# EAGLE design LoRa-Messenger-v1.1 (EAGLE 8.6.0)
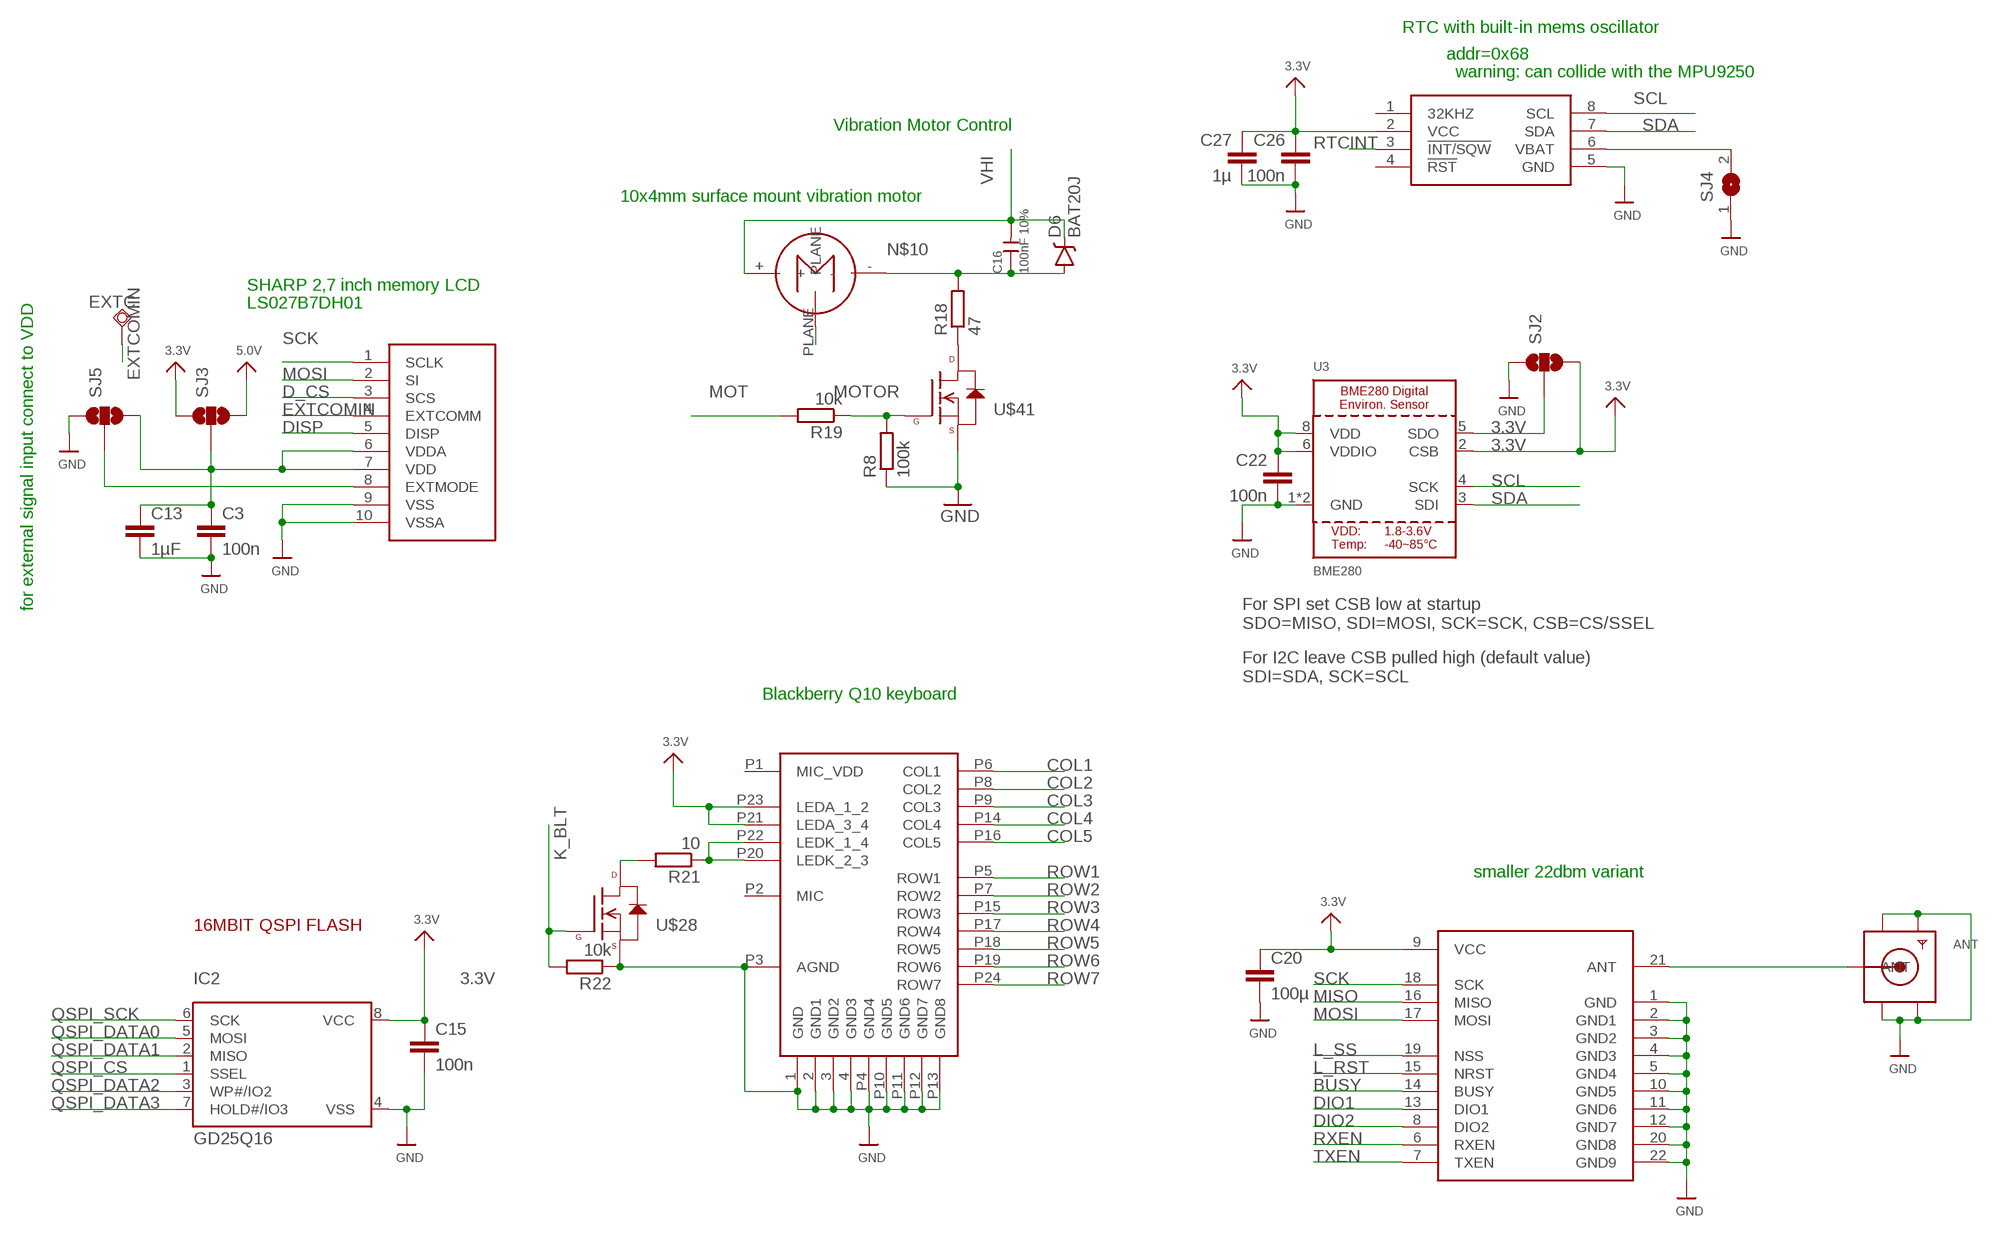
[diagram p0: schematic, sheet 1, part 1 of 3]
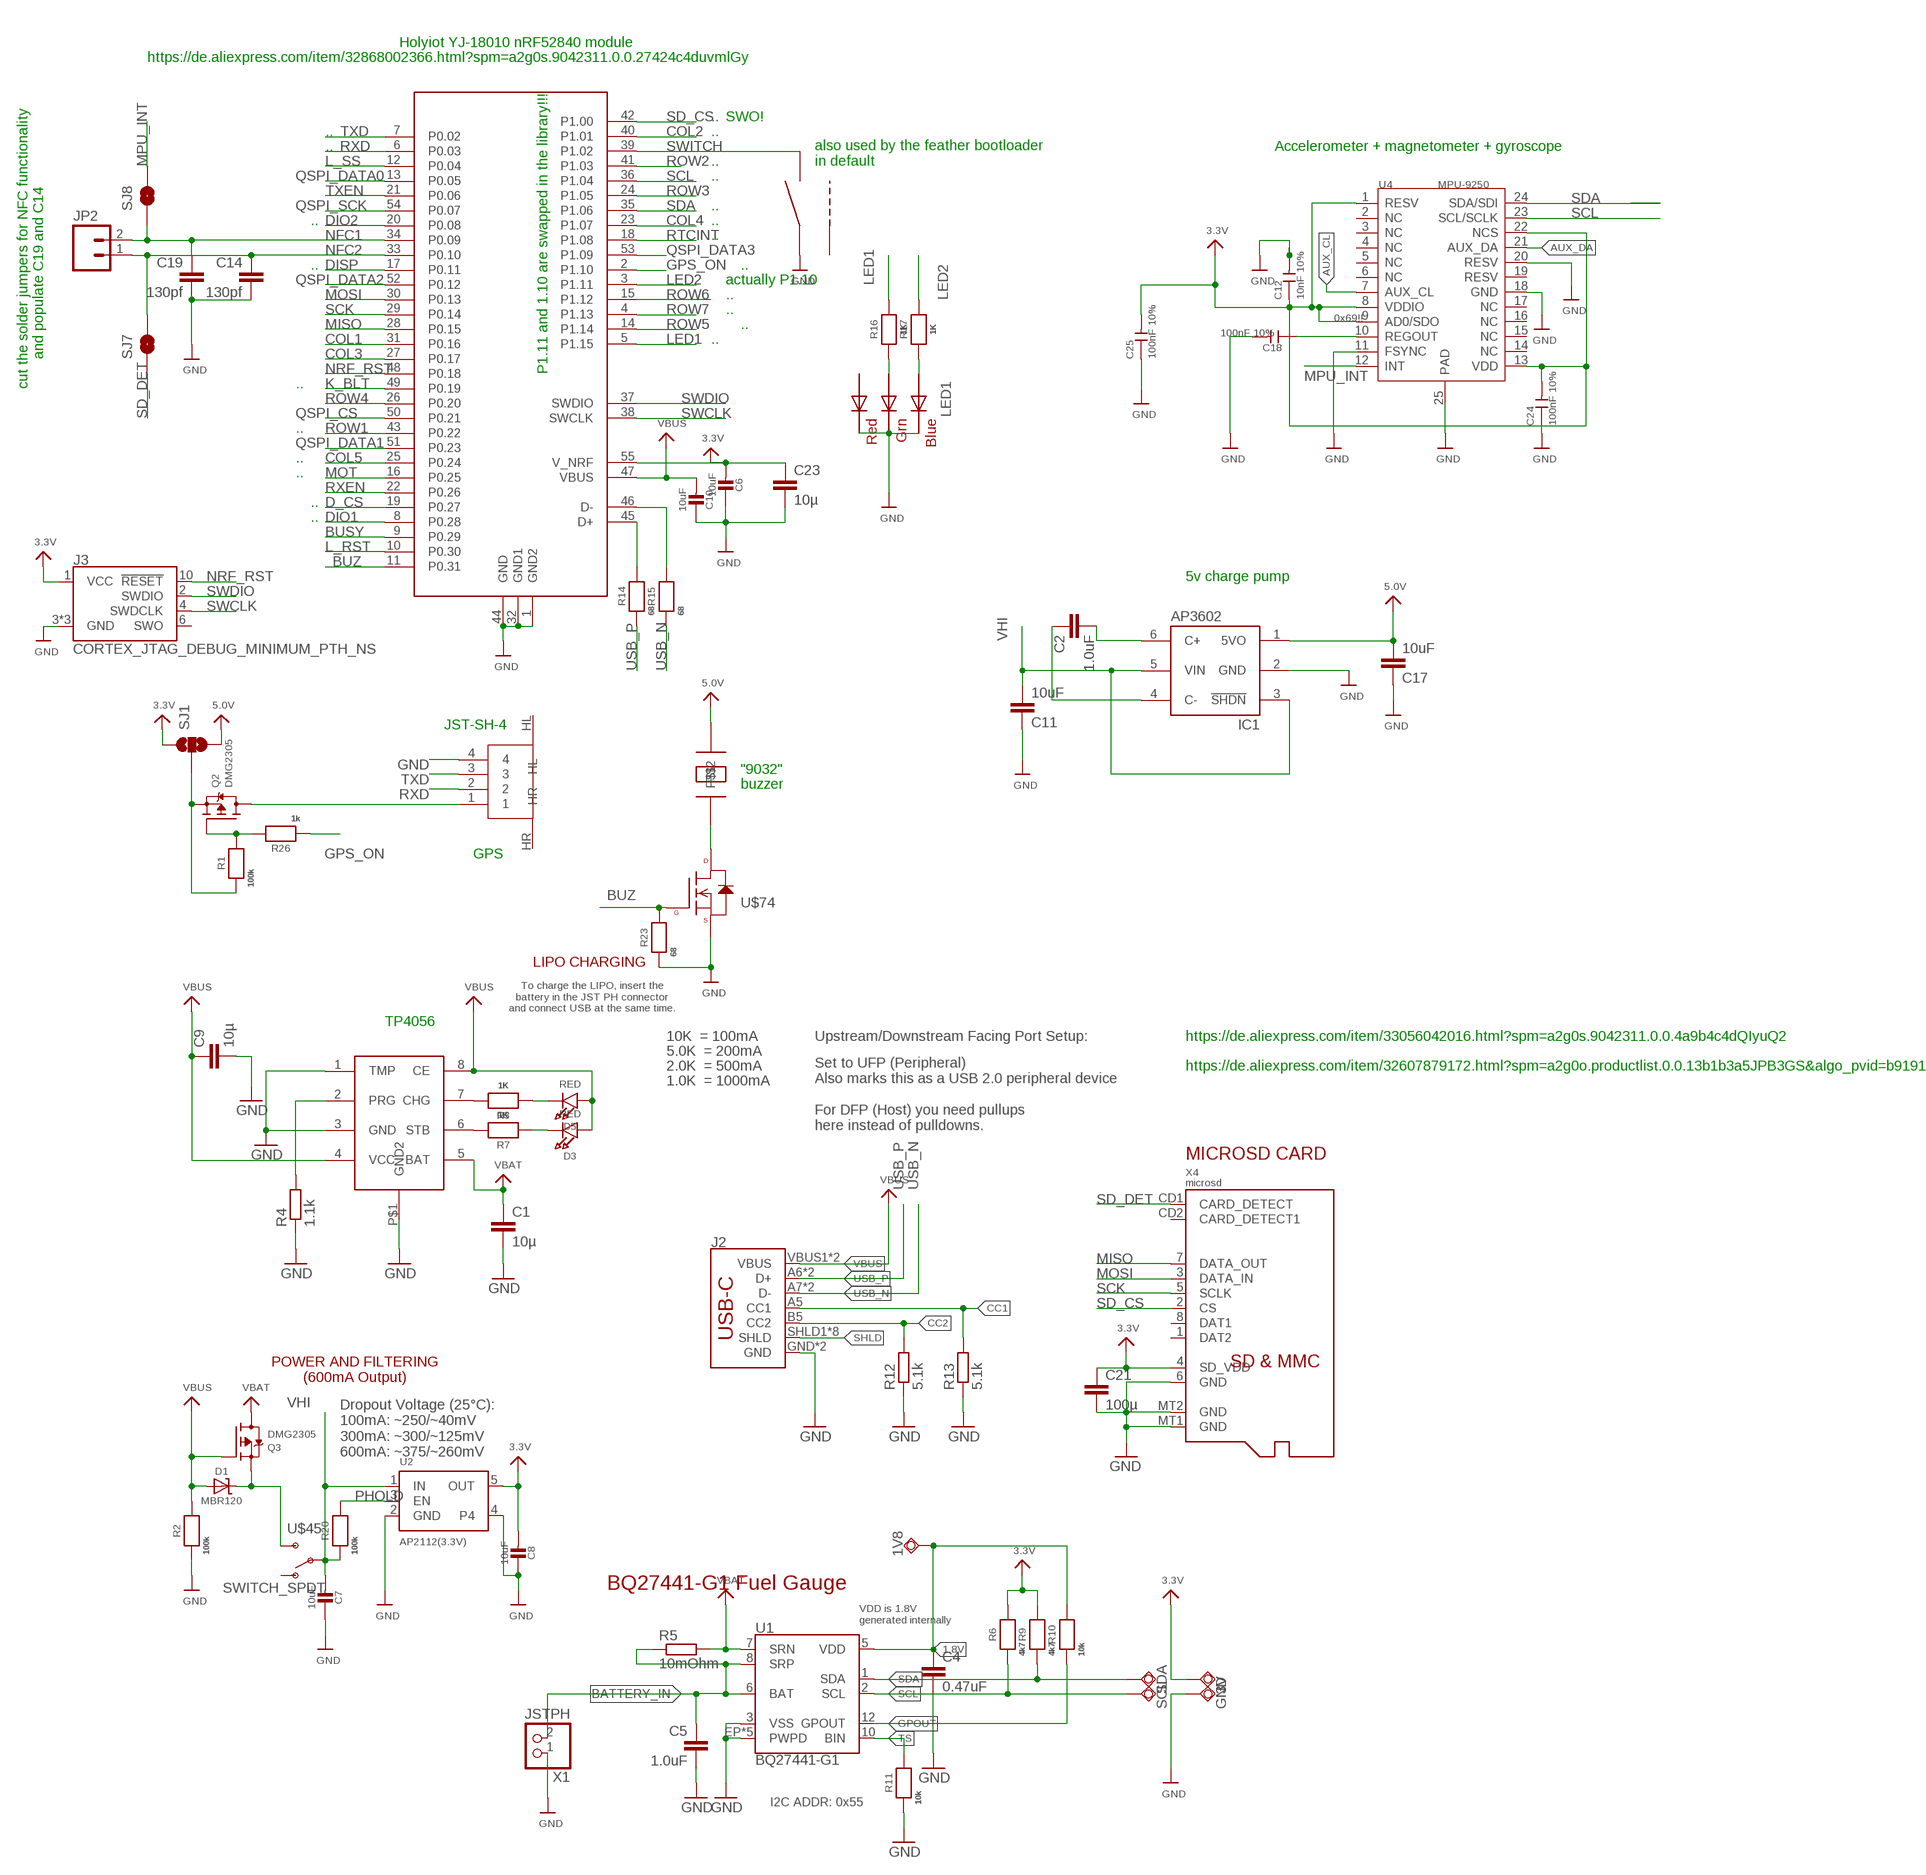
[diagram p1: schematic, sheet 1, part 2 of 3]
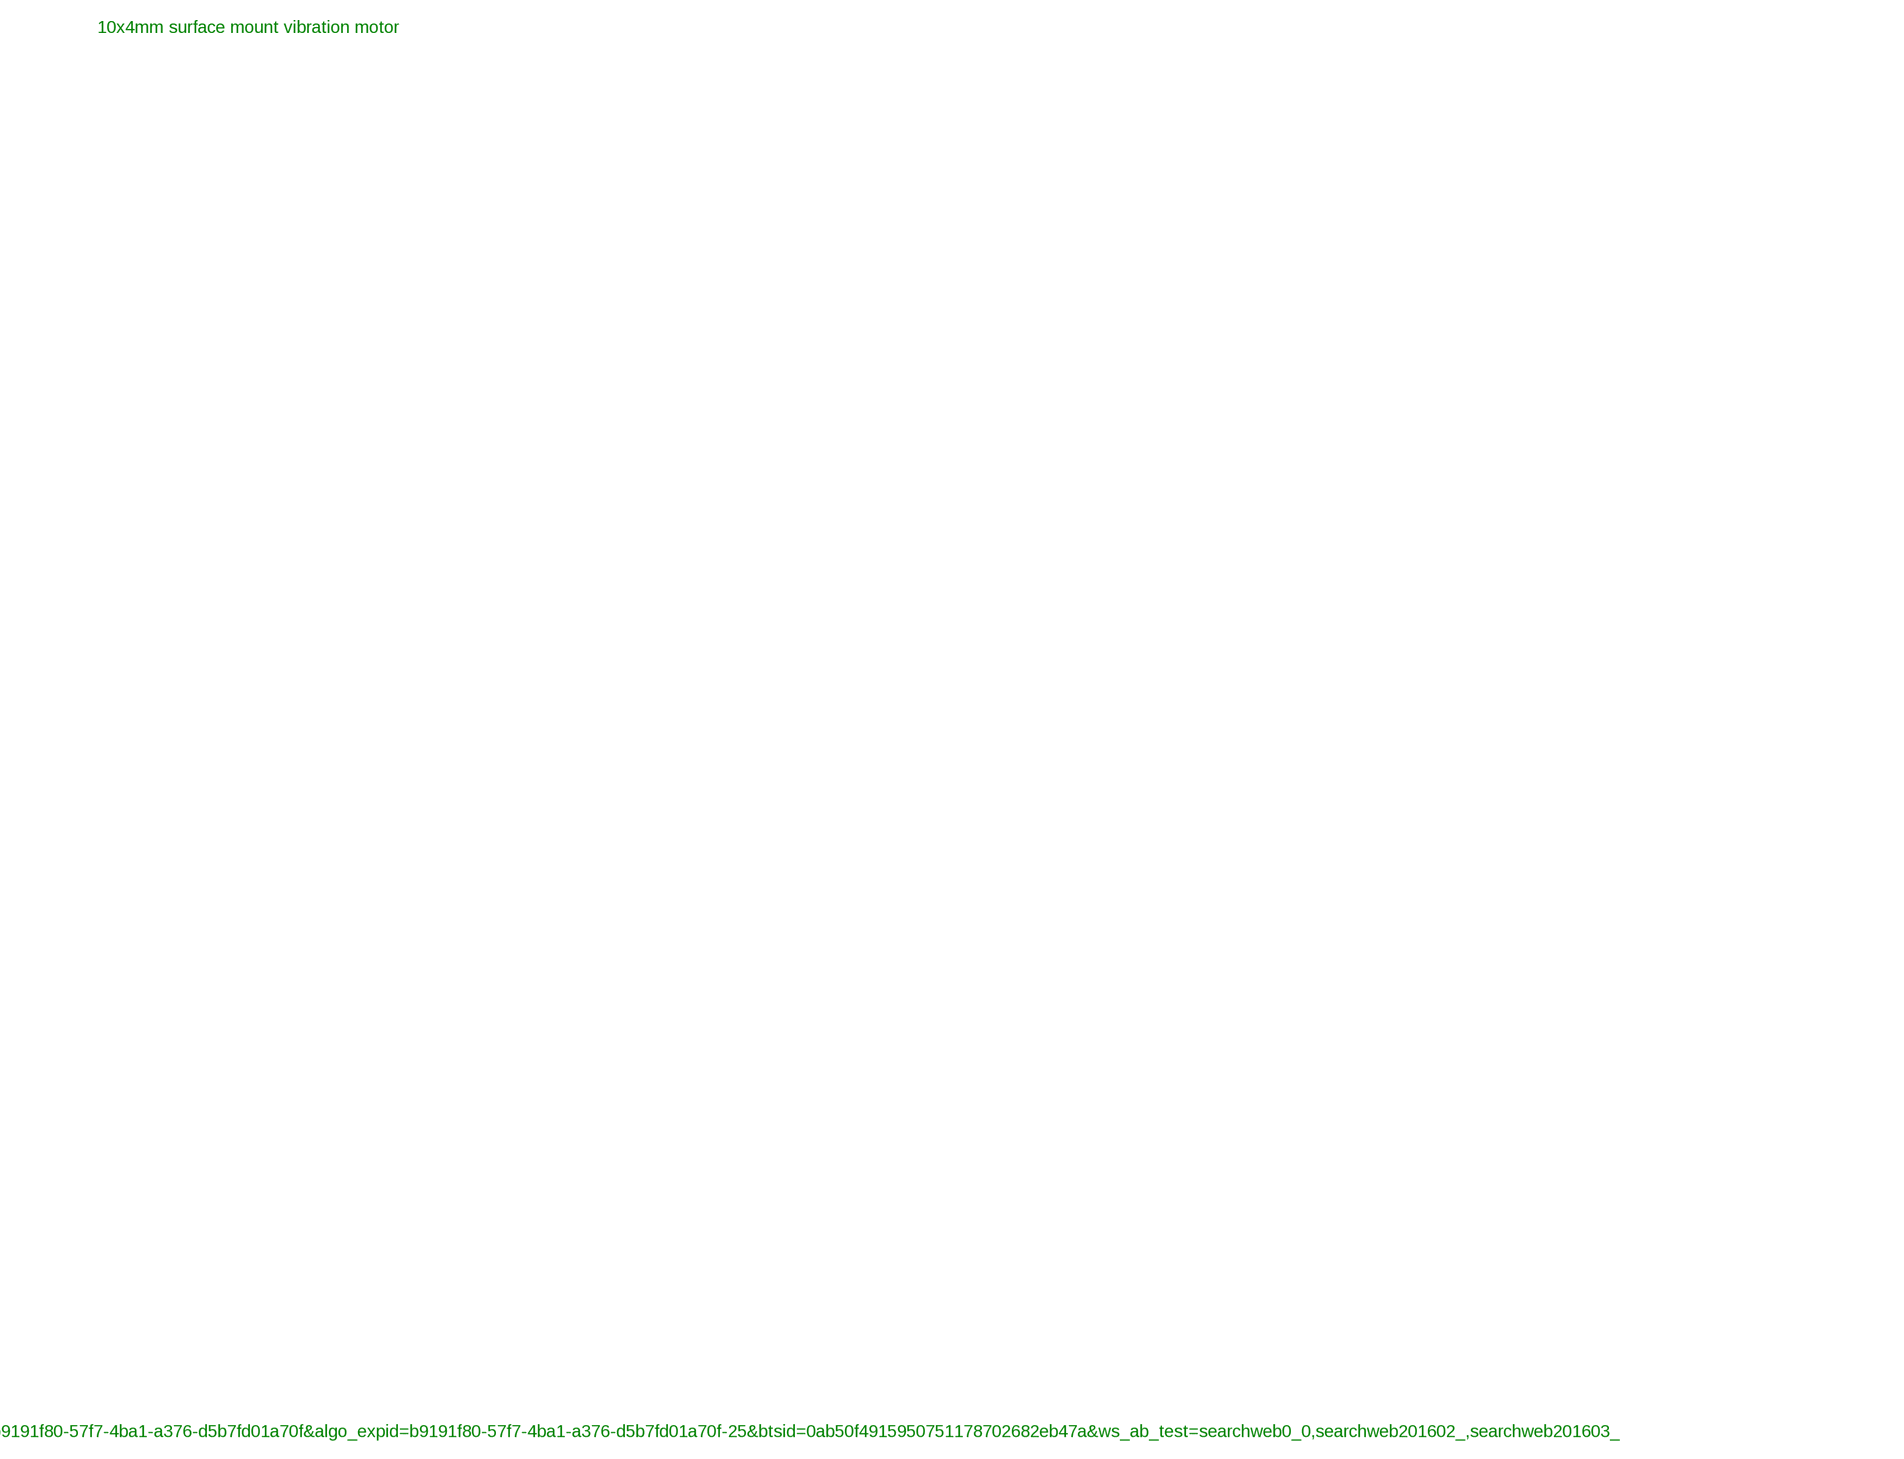
[diagram p2: schematic, sheet 1, part 3 of 3]

## Parts
1V8  TPSQTP13R  [TP13R]
3V  TPSQTP13R  [TP13R]
ANT  SMACONNECTOR_EDGE  [SMA_EDGELAUNCH]
C1  10µ  C-EUC0805  [C0805]
C2  1.0uF  1.0UF-16V-10%(0603)  [0603-CAP]
C3  100n  C-EUC0402  [C0402]
C4  0.47uF  CAP0603-CAP  [0603-CAP]
C5  1.0uF  1.0UF-16V-10%(0603)  [0603-CAP]
C6  10uF  CAP_CERAMIC0805-NOOUTLINE  [0805-NO]
C7  10uF  CAP_CERAMIC0805-NOOUTLINE  [0805-NO]
C8  10uF  CAP_CERAMIC0805-NOOUTLINE  [0805-NO]
C9  10µ  C-EUC0805  [C0805]
C10  10uF  CAP_CERAMIC0805-NOOUTLINE  [0805-NO]
C11  10uF  1.0UF-16V-10%(0603)  [0603-CAP]
C12  10nF 10%  CAP-0603  [C0603]
C13  1µF  C-EUC0402  [C0402]
C14  130pf  1.0UF-16V-10%(0603)  [0603-CAP]
C15  100n  C-EUC0402  [C0402]
C16  100nF 10%  CAP-0603  [C0603]
C17  10uF  1.0UF-16V-10%(0603)  [0603-CAP]
C18  100nF 10%  CAP-0603  [C0603]
C19  130pf  1.0UF-16V-10%(0603)  [0603-CAP]
C20  100µ  C-EUC1206  [C1206]
C21  100µ  C-EUC1206  [C1206]
C22  100n  1.0UF-16V-10%(0603)  [0603-CAP]
C23  10µ  C-EUC0805  [C0805]
C24  100nF 10%  CAP-0603  [C0603]
C25  100nF 10%  CAP-0603  [C0603]
C26  100n  1.0UF-16V-10%(0603)  [0603-CAP]
C27  1µ  1.0UF-16V-10%(0603)  [0603-CAP]
D1  MBR120  DIODE-SCHOTTKYSOD-123  [SOD-123]
D3  RED  LED0805_NOOUTLINE  [CHIPLED_0805_NOOUTLINE]
D5  RED  LED0805_NOOUTLINE  [CHIPLED_0805_NOOUTLINE]
D6  BAT20J  DIODE-SCHOTTKY-BAT20J  [SOD-323]
DWN2  LS12T2  [LS12T2]
EXTC.  TPSQTP13R  [TP13R]
GND  TPSQTP13R  [TP13R]
IC1  AP3602  [SOT23-6]
IC2  GD25Q16  SPIFLASH_8PINUX  [USON8]
J2  USB_C16PIN  [USB-C-16P]
J3  CORTEX_JTAG_DEBUG_MINIMUM_PTH_NS  [2X5-PTH-1.27MM-NO_SILK]
JP2  M02PTH  [1X02]
LED1  RGBLED5050  [RGBLED5050]
Q2  DMG2305  MOSFET-P  [SOT23-R]
Q3  DMG2305  MOSFET-P  [SOT23-R]
R1  100k  RESISTOR_0603_NOOUT  [0603-NO]
R2  100k  RESISTOR_0603_NOOUT  [0603-NO]
R3  1K  RESISTOR_0603_NOOUT  [0603-NO]
R4  1.1k  R-EU_R0603  [R0603]
R5  10mOhm  R-EU_R0805  [R0805]
R6  4k7  RESISTOR_0603_NOOUT  [0603-NO]
R7  1K  RESISTOR_0603_NOOUT  [0603-NO]
R8  100k  R-EU_R0603  [R0603]
R9  4k7  RESISTOR_0603_NOOUT  [0603-NO]
R10  10k  RESISTOR_0603_NOOUT  [0603-NO]
R11  10k  RESISTOR_0603_NOOUT  [0603-NO]
R12  5.1k  R-EU_R0603  [R0603]
R13  5.1k  R-EU_R0603  [R0603]
R14  68  RESISTOR_0603_NOOUT  [0603-NO]
R15  68  RESISTOR_0603_NOOUT  [0603-NO]
R16  1K  RESISTOR_0603_NOOUT  [0603-NO]
R17  1K  RESISTOR_0603_NOOUT  [0603-NO]
R18  47  R-EU_R0603  [R0603]
R19  10k  R-EU_R0603  [R0603]
R20  100k  RESISTOR_0603_NOOUT  [0603-NO]
R21  10  R-EU_R0603  [R0603]
R22  10k  R-EU_R0603  [R0603]
R23  68  RESISTOR_0603_NOOUT  [0603-NO]
R26  1k  RESISTOR_0603_NOOUT  [0603-NO]
SCL  TPSQTP13R  [TP13R]
SDA  TPSQTP13R  [TP13R]
SJ1  SOLDERJUMPER_2WAY-OLDS  [SJ_3]
SJ2  SOLDERJUMPER_2WAY-OLDS  [SJ_3]
SJ3  SOLDERJUMPER_2WAY-OLDS  [SJ_3]
SJ4  SJ  [SJ]
SJ5  SOLDERJUMPER_2WAY-OLDS  [SJ_3]
SJ7  SOLDERJUMPERTRACE  [SJ_2S-TRACE]
SJ8  SOLDERJUMPERTRACE  [SJ_2S-TRACE]
U1  BQ27441-G1  [PDSO-N12]
U2  AP2112(3.3V)  VREG_SOT23-5  [SOT23-5]
U3  BME280  [BME280]
U4  MPU-9250  [LEAD-QFN24]
U$2  BUZZER  [BUZZER]
U$7  Q10KEYBOARD  [Q10KEYBOARD]
U$10  AYF531035_SHARP_MEM_DISP  [AYF531035_Y5BW]
U$14  NRF52840  [NRF52840MOD]
U$17  JST-SH-3  [JST-SH-3]
U$28  N-CHANNEL-MOSFET-BSS138  [SOT23-3]
U$36  SX1292-EBYTE  [SX1262_EBYTE]
U$41  N-CHANNEL-MOSFET-BSS138  [SOT23-3]
U$45  SWITCH_SPDT  [KPS-1290]
U$46  VIBRO  [VIBRO]
U$47  TP4056BETTER_TP4056  [TP4056BETTER_SO-08]
U$69  DS3231M  [SO8]
U$74  N-CHANNEL-MOSFET-BSS138  [SOT23-3]
X1  JSTPH  CON_JST_PH_2PIN  [JSTPH2]
X4  microsd  MICROSD  [MICROSD]

## Nets
1.8V: 1V8.TP C4.1 R10.2 U1.5(VDD)
3.3V [power]: 3V.TP C6.2 C8.2 C12.1 C15.1 C20.1 C21.1 C22.1 C23.1 C24.2 C25.2 C26.1 C27.1 IC2.8(VCC) J3.1(VCC) R6.2 R9.2 SJ1.1 SJ2.3 SJ3.1 U2.5(OUT) U3.2(CSB) U3.6(VDDIO) U3.8(VDD) U4.1(RESV) U4.8(VDDIO) U4.9(AD0/SDO) U4.13(VDD) U4.22(NCS) U$7.P21(LEDA_3_4) U$7.P23(LEDA_1_2) U$14.55(V_NRF) U$36.9(VCC) U$69.2(VCC) X4.4(SD_VDD)
5.0V: C17.2 IC1.1(5VO) SJ1.3 SJ3.3 U$2.P$1
AUX_CL: U4.7(AUX_CL)
AUX_DA: U4.21(AUX_DA)
BATTERY_IN: C5.1 R5.1 U1.6(BAT) U1.8(SRP) X1.2
BUSY: U$14.9(P0.29) U$36.14(BUSY)
BUZ: R23.2 U$14.11(P0.31) U$74.1(G)
CC1: J2.A5(CC1) R13.2
CC2: J2.B5(CC2) R12.2
COL1: U$7.P6(COL1) U$14.31(P0.16)
COL2: U$7.P8(COL2) U$14.40(P1.01)
COL3: U$7.P9(COL3) U$14.27(P0.17)
COL4: U$7.P14(COL4) U$14.23(P1.07)
COL5: U$7.P16(COL5) U$14.25(P0.24)
D_CS: U$10.3(SCS) U$14.19(P0.27)
DIO1: U$14.8(P0.28) U$36.13(DIO1)
DIO2: U$14.20(P0.08) U$36.8(DIO2)
DISP [power]: U$10.5(DISP) U$14.17(P0.11)
EXTCOMIN: EXTC..TP U$10.4(EXTCOMM)
GND: ANT.GND@1(GND4) ANT.GND@2(GND3) ANT.GND@3(GND2) ANT.GND@4(GND1) C1.2 C3.2 C4.2 C5.2 C6.1 C7.1 C8.1 C9.2 C10.1 C11.1 C12.2 C13.2 C14.2 C15.2 C17.1 C18.2 C19.2 C20.2 C21.2 C22.2 C23.2 C24.1 C25.1 C26.2 C27.2 DWN2.2 GND.TP IC1.2(GND) IC2.4(VSS) J2.GND J2.GND2(GND) J3.3(GND) J3.5(GND) J3.9(GND) LED1.4(BLUE_C) LED1.5(RED_C) LED1.6(GREEN_C) R2.1 R4.1 R8.1 R11.1 R12.1 R13.1 R22.1 R23.1 SJ2.1 SJ4.1 SJ5.1 U1.3(VSS) U1.EP1(PWPD) U1.EP2(PWPD) U1.EP3(PWPD) U1.EP4(PWPD) U1.EP(PWPD) U2.2(GND) U2.4 U3.1(GND) U3.7(GND) U4.11(FSYNC) U4.18(GND) U4.20(RESV) U4.25(PAD) U$7.1(GND) U$7.2(GND1) U$7.3(GND2) U$7.4(GND3) U$7.P3(AGND) U$7.P4(GND4) U$7.P10(GND5) U$7.P11(GND6) U$7.P12(GND7) U$7.P13(GND8) U$10.9(VSS) U$10.10(VSSA) U$14.1(GND2) U$14.32(GND1) U$14.44(GND) U$17.4 U$28.2(S) U$36.1(GND) U$36.2(GND1) U$36.3(GND2) U$36.4(GND3) U$36.5(GND4) U$36.10(GND5) U$36.11(GND6) U$36.12(GND7) U$36.20(GND8) U$36.22(GND9) U$41.2(S) U$47.1(TMP) U$47.3(GND) U$47.P$1(GND2) U$69.5(GND) U$74.2(S) X1.1 X4.6(GND) X4.MT1(GND) X4.MT2(GND)
GPOUT: R10.1 U1.12(GPOUT)
GPS_ON: R26.1 U$14.2(P1.10)
K_BLT: R22.2 U$14.49(P0.19) U$28.1(G)
L_RST: U$14.10(P0.30) U$36.15(NRST)
L_SS: U$14.12(P0.04) U$36.19(NSS)
LED1: R16.2 U$14.5(P1.15)
LED2: R17.2 U$14.3(P1.11)
MISO: U$14.28(P0.15) U$36.16(MISO) X4.7(DATA_OUT)
MOSI: U$10.2(SI) U$14.30(P0.13) U$36.17(MOSI) X4.3(DATA_IN)
MOT: R19.2 U$14.16(P0.25)
MOTOR: R8.2 R19.1 U$41.1(G)
MPU_INT: SJ8.2 U4.12(INT)
N$1: R3.2 U$47.7(CHG)
N$2: C2.2 IC1.6(C+)
N$3: C2.1 IC1.4(C-)
N$4 [power]: D1.C Q3.2(S) U$45.S
N$5: Q2.1(G) R1.2 R26.2
N$6: R14.2 U$14.45(D+)
N$7: R15.2 U$14.46(D-)
N$8: R7.2 U$47.6(STB)
N$9: R18.1 U$41.3(D)
N$10: C16.1 D6.A R18.2 U$46.-
N$11: D5.C R3.1
N$12: D3.C R7.1
N$13: LED1.1(GREEN_A) R16.1
N$15: Q2.3(D) U$17.1
N$17: R21.1 U$7.P20(LEDK_2_3) U$7.P22(LEDK_1_4)
N$18: Q2.2(S) R1.1 SJ1.2
N$19: R21.2 U$28.3(D)
N$20: ANT.P(ANT) U$36.21(ANT)
N$21: LED1.3(BLUE_A) R17.1
N$25: SJ2.2 U3.5(SDO)
N$30: U$2.P$2 U$74.3(D)
N$41: C18.1 U4.10(REGOUT)
N$43: SJ4.2 U$69.6(VBAT)
N$44: C3.1 C13.1 SJ3.2 SJ5.3 U$10.6(VDDA) U$10.7(VDD)
N$45: SJ5.2 U$10.8(EXTMODE)
NFC1: C19.1 JP2.2 SJ8.1 U$14.34(P0.09)
NFC2: C14.1 JP2.1 SJ7.2 U$14.33(P0.10)
NRF_RST: J3.10(!RESET) U$14.48(P0.18)
PHOLD: R20.2 U2.3(EN)
PLANE: U$46.PLANE
PRG: R4.2 U$47.2(PRG)
QSPI_CS: IC2.1(SSEL) U$14.50(P0.21)
QSPI_DATA0: IC2.5(MOSI) U$14.13(P0.05)
QSPI_DATA1: IC2.2(MISO) U$14.51(P0.23)
QSPI_DATA2: IC2.3(WP#/IO2) U$14.52(P0.12)
QSPI_DATA3: IC2.7(HOLD#/IO3) U$14.53(P1.09)
QSPI_SCK: IC2.6(SCK) U$14.54(P0.07)
ROW1: U$7.P5(ROW1) U$14.43(P0.22)
ROW2: U$7.P7(ROW2) U$14.41(P1.03)
ROW3: U$7.P15(ROW3) U$14.24(P1.05)
ROW4: U$7.P17(ROW4) U$14.26(P0.20)
ROW5: U$7.P18(ROW5) U$14.14(P1.14)
ROW6: U$7.P19(ROW6) U$14.15(P1.12)
ROW7: U$7.P24(ROW7) U$14.4(P1.13)
RTCINT: U$14.18(P1.08) U$69.3(!INT/SQW)
RXD: U$14.6(P0.03) U$17.2
RXEN: U$14.22(P0.26) U$36.6(RXEN)
SCK: U$10.1(SCLK) U$14.29(P0.14) U$36.18(SCK) X4.5(SCLK)
SCL: R6.1 SCL.TP U1.2(SCL) U3.4(SCK) U4.23(SCL/SCLK) U$14.36(P1.04) U$69.8(SCL)
SD_CS: U$14.42(P1.00) X4.2(CS)
SD_DET: SJ7.1 X4.CD1(CARD_DETECT)
SDA: R9.1 SDA.TP U1.1(SDA) U3.3(SDI) U4.24(SDA/SDI) U$14.35(P1.06) U$69.7(SDA)
SHLD: J2.SHLD1(SHLD) J2.SHLD2(SHLD) J2.SHLD3(SHLD) J2.SHLD4(SHLD) J2.SHLD5(SHLD) J2.SHLD6(SHLD) J2.SHLD7(SHLD) J2.SHLD8(SHLD)
SWCLK: J3.4(SWDCLK) U$14.38(SWCLK)
SWDIO: J3.2(SWDIO) U$14.37(SWDIO)
SWITCH: DWN2.1 U$14.39(P1.02)
TS: R11.2 U1.10(BIN)
TXD: U$14.7(P0.02) U$17.3
TXEN: U$14.21(P0.06) U$36.7(TXEN)
USB_N: J2.A7(D-) J2.B7(D-) R15.1
USB_P: J2.A6(D+) J2.B6(D+) R14.1
VBAT [power]: C1.1 Q3.3(D) R5.2 U1.7(SRN) U$47.5(BAT)
VBUS [power]: C9.1 C10.2 D1.A D3.A D5.A J2.VBUS1(VBUS) J2.VBUS2(VBUS) Q3.1(G) R2.2 U$14.47(VBUS) U$47.4(VCC) U$47.8(CE)
VHI [power]: C7.2 C11.2 C16.2 D6.C IC1.3(!SHDN) IC1.5(VIN) R20.1 U2.1(IN) U$45.P U$46.+
Unconnected: DWN2.FRAME(FRM) J3.6(SWO) LED1.2(RED_A) U4.2(NC) U4.3(NC) U4.4(NC) U4.5(NC) U4.6(NC) U4.14(NC) U4.15(NC) U4.16(NC) U4.17(NC) U4.19(RESV) U$7.P1(MIC_VDD) U$7.P2(MIC) U$17.HL U$17.HR U$45.O U$69.1(32KHZ) U$69.4(!RST) X4.1(DAT2) X4.8(DAT1) X4.CD2(CARD_DETECT1)

## Notes on the sheet
- RTC with built-in mems oscillator
- addr=0x68
- warning: can collide with the MPU9250
- Vibration Motor Control
- 10x4mm surface mount vibration motor
- SHARP 2,7 inch memory LCD
- LS027B7DH01
- for external signal input connect to VDD
- For SPI set CSB low at startup
  SDO=MISO, SDI=MOSI, SCK=SCK, CSB=CS/SSEL
- For I2C leave CSB pulled high (default value)
  SDI=SDA, SCK=SCL
- Blackberry Q10 keyboard
- smaller 22dbm variant
- 16MBIT QSPI FLASH
- 10x4mm surface mount vibration motor
- Holyiot YJ-18010 nRF52840 module
- https://de.aliexpress.com/item/32868002366.html?spm=a2g0s.9042311.0.0.27424c4duvmlGy
- .. | SWO!
- .. | ..
- .. | Accelerometer + magnetometer + gyroscope
- ..
- also used by the feather bootloader 
  in default
- ..
- ..
- .. | ..
- ..
- .. | ..
- actually P1.10
- ..
- ..
- 0x69!!
- ..
- ..
- and populate C19 and C14
- P1.11 and 1.10 are swapped in the library!!!
- cut the solder jumpers for NFC functionality | ..
- ..
- ..
- ..
- ..
- ..
- 5v charge pump
- JST-SH-4
- "9032"
- buzzer
- GPS
- LIPO CHARGING
- To charge the LIPO, insert the
  battery in the JST PH connector
  and connect USB at the same time.
- TP4056
- 10K  = 100mA | Upstream/Downstream Facing Port Setup: | https://de.aliexpress.com/item/33056042016.html?spm=a2g0s.9042311.0.0.4a9b4c4dQIyuQ2
- 5.0K  = 200mA
- 2.0K  = 500mA | https://de.aliexpress.com/item/32607879172.html?spm=a2g0o.productlist.0.0.13b1b3a5JPB3GS&algo_pvid=b9191f80-57f7-4ba1-a376-d5b7fd01a70f&algo_expid=b9191f80-57f7-4ba1-a376-d5b7fd01a70f-25&btsid=0ab50f4915950751178702682eb47a&ws_ab_test=searchweb0_0,searchweb201602_,searchweb201603_
- 1.0K  = 1000mA
- Set to UFP (Peripheral)
  Also marks this as a USB 2.0 peripheral device
  
  For DFP (Host) you need pullups
  here instead of pulldowns.
- MICROSD CARD
- POWER AND FILTERING
  (600mA Output)
- Dropout Voltage (25°C):
  100mA: ~250/~40mV
  300mA: ~300/~125mV
  600mA: ~375/~260mV
- BQ27441-G1 Fuel Gauge
- VDD is 1.8V
  generated internally
- I2C ADDR: 0x55

## Library data of the parts
1V8 3V EXTC. GND SCL SDA = testpad:TPSQ: Test pad
ANT = adafruit:SMACONNECTOR: SMA Connector 90° DIP SMA Connector, 50 Ohm (4UConnector: 07259)
C1 C9 C20 C21 C23 = rcl:C-EU: CAPACITOR, European symbol; SPICEPREFIX: C
C2 C5 = SparkFun-Capacitors:1.0UF-16V-10%(0603): CAP-00868; PROD_ID: CAP-00868
C3 C13 C15 = rcl:C-EU: CAPACITOR, European symbol
C4 = SparkFun-Capacitors:CAP: Capacitor Standard 0603 ceramic capacitor, and 0.1" leaded capacitor.; PROD_ID: CAP-13216
C6-C8 C10 = microbuilder:CAP_CERAMIC: Ceramic Capacitors For new designs, use the packages preceded by an '_' character since they are more reliable: The following footprints should be used on most boards: _0402 - Standard footprint for regular board layouts _0603 - Standard footprint for regular board layouts _0805 - Standard footprint for regular board layouts _1206 - Standard footprint for regular board layouts For extremely tight-pitch boards where space is at a premium, the following 'micro-pitch' footprints can be used (smaller pads, no silkscreen outline, etc.): _0402MP - Micro-pitch footprint for very dense/compact boards _0603MP - Micro-pitch footprint for very dense/compact boards _0805MP - Micro-pitch footprint for very dense/compact boards _1206MP - Micro-pitch footprint for very dense/compact boards
C11 C14 C17 C19 C22 C26 C27 = SparkFun-Capacitors:1.0UF-16V-10%(0603): CAP-00868; PROD_ID: CAP-00868; VALUE: 1.0uF
C12 C16 C18 C24 C25 = Discrete-new:CAP: Ceramic Capacitors
D1 = microbuilder:DIODE-SCHOTTKY
D3 D5 = microbuilder:LED: LED 0603 - 0603 Surface Mount Package 2mA: Green LED - Low Power (3.9mcd, 2ma, 1.7Vf) - Digikey: 475-2709-2-ND Orange LED - Low Power (9.8mcd, 2ma, 1.8Vf) - Digikey: 475-1194-2-ND Red LED - Low Power (5mcd, 2ma, 1.8Vf) - Digikey: 475-1195-2-ND Yellow LED - Low Power (7mcd, 2ma, 1.8Vf) - Digikey: 475-1196-2-ND 5mA: Blue LED - Low Power (17mcd, 5ma, 2.9Vf) - Digikey: LNJ937W8CRACT-ND 0805 - 0805 Surface Mount Package 2mA: Red LED (8.8mcd, 2mA, 1.8Vf, Clear) - Low Power [Digikey: 475-2510-1-ND] Green LED (5mcd, 2mA, 1.8Vf, Clear) - Low Power [Digikey: 475-2730-1-ND] Yellow LED (11.3mcd, 2mA, 1.8Vf, Clear) - Low Power [Digikey: 475-2555-1-ND] 20mA: Red LED (104mcd, 20mA, Diffused) - LS R976 [Digikey: 475-1278-6-ND] Red LED (12mcd, 20mA, 2.0Vf, Clear) - APT2012EC [Digikey: 754-1128-1-ND] Green LED (15mcd, 20mA, 2.2Vf, Clear) - APT2012GC [Digikey: 754-1131-1-ND] Orange LED (160mcd, 20mA, 2.1Vf, Clear) - APT2012SECK [Digikey: 754-1130-1-ND] 1206 - 1206 Surface Mount Package Green LED (26mcd, 20mA, Diffused) - LG N971 [Digikey: 475-1407-6-ND] Red LED (15mcd, 20mA, Diffused) - LH N974 [Digikey: 475-1416-6-ND] Cree - Cree High-Power Surface Mount LEDs XPEBWT-L1-0000-00D50 - White 111lm 350mA 2.9Vf 6200K 110° XTEAWT-00-0000-00000LEE3 - White 114lm 350mA 2.85Vf 5000K 115° Everlight - Everlight 45-21 Series Surface Mount LEDs 45-21/QK2C-B2832AC2CB2/2T - Warm White 2000mcd 20mA 3.25Vf 3050K 120° 45-21/LK2C-B38452C4CB2/2T - Nuetral White 2000mcd 20mA 3.25Vf 4150K 120° 45-21/LK2C-B50634C6CB2/2T - Cold White 2200mcd 20mA 3.25Vf 5650K 120° PLCC2 Reverse Mount LS T77K-J1L2-1-0-2-R18-Z - Red 11.25mcd 2mA 1.8Vf 630nm 120° LO T77K-L1M2-24-Z - Orange 19.6mcd 2mA 1.8Vf 606nm 120° LY T77K-K2M1-26-Z - Yellow 15.7mcd 2mA 1.8Vf 587nm 120°
D6 = SparkFun-DiscreteSemi:DIODE-SCHOTTKY: Schottky diodes in SFE's production catalog BAT20J 1A 23V 0.62Vf RB751 120mA 40V 0.37Vf PMEG4005EJ 0.5A 40V 0.42Vf MBRA140 1A 40V 0.5Vf B340A 3A 40V SMA; PROD_ID: DIO-11623
DWN2 = LS12T2:LS12T2
IC1 = microbuilder:AP3602
IC2 = microbuilder:SPIFLASH_8PIN: SOIC8 SPI Flash Be careful with the size since SOIC8 flash comes in several 'widths' SOIC8 150 mil M25P16 - 16Mbit (2Mbit x 8) Serial Flash (75MHz SPI Bus), Supply: 2.7-3.6V Digikey: SOIC8 - M25P16-VMN6P-ND SOIC8 208 mil W25Q16BVSSIG - 16Mbit (2Mbit x 8) Serial Flash (104MHz SPI Bus), Supply: 2.7-3.6V Digikey: SOIC8 - W25Q16BVSSIG-ND
J2 = SparkFun-Connectors:USB_C: USB Type C 16Pin Connector Super Speed pins not available on the 16-pin purely SMD connector so this part is best for USB 2.0 implementations. D1 and D2 are tied together enabling D+/- no matter which way the cable is plugged into the connector. The two channel configuration pins (CC1/2) are exposed. These are normally connected to ground via 5.1k resistors but can be reconfigured for high current/high power applications.; PROD_ID: CONN-14122
J3 = SparkFun-Connectors:CORTEX_JTAG_DEBUG_MINIMUM: Cortex Debug Connector - 10 pin Supports JTAG debug, Serial Wire debug, and Serial Wire Viewer. PTH and SMD connector options available. General Connector Information <http://infocenter.arm.com/help/topic/com.arm.doc.faqs/attached/13634/cortex_debug_connectors.pdf> Products: PTH Connector <http://www.digikey.com/product-detail/en/cnc-tech/3220-10-0100-00/1175-1627-ND/3883661> -via Digi-Key SparkFun PSoc <https://www.sparkfun.com/products/13229> SparkFun T <https://www.sparkfun.com/products/13810>
JP2 = SparkFun-Connectors:M02: Standard 2-pin 0.1" header. Use with - straight break away headers ( PRT-00116) - right angle break away headers (PRT-00553) - swiss pins (PRT-00743) - machine pins (PRT-00117) - female headers (PRT-00115) Molex polarized connector foot print use with: PRT-08233 with associated crimp pins and housings. 2.54_SCREWTERM for use with PRT-10571. 3.5mm Screw Terminal footprints for PRT-08084 5mm Screw Terminal footprints for use with PRT-08432
LED1 = adafruit:RGBLED: For 5050 RGB LEDs, the order of the LEDs may vary from one manufacturer to another!
Q2 Q3 = microbuilder:MOSFET-P: P-Channel Mosfet LEGEND VDS: Voltage Drain-Source ID: Drain Current RDS(ON): Drain-Source On-State Resistance VGS(TH): Gate-Source Threshold Voltage CISS: Drain-Source Input Capacitance SOT-23 Name VDS ID RDS(ON) VGS(TH) CISS Order Number IRLML5103 30V 760mA 600 mOhm -- 75pF @ 25V Digikey: IRLML5103PBFCT-ND IRLML6401 12V 4.3A 50 mOhm 950mV @ 250µA 830pF @ 10V Digikey: IRLML6401PBFTR-ND NTR0202PL 20V 400mA 800 mOhm 2.3V @ 250uA 70pF @ 5V Digikey: NTR0202PLT1GOSTR-ND NTR4101PT1G 20V 1.8A 85 mOhm 1.2V @ 250uA 675pF @ 10V Digikey: NTR4101PT1GOSCT-ND DMP2004K 20V 600mA 900 mOhm 1V @ 250uA 175pF @ 16V Digikey: DMP2004KDICT-ND PMV65XP 20V 3.9A 76 mOhm 950mV @ 1mA 725pF @ 20V Digikey: 568-2358-2-ND TO-252 Name VDS ID RDS(ON) VGS(TH) CISS Order Number AOD417 30V 25A 34 mOhm 3V @ 250µA 920pF @ 15V Digikey: 785-1106-2-ND PowerPak Name VDS ID RDS(ON) VGS(TH) CISS Order Number AON7401 30V 12A 14 mOhm 3V @ 250µA 2600pF @ 15V Digikey: 785-1302-1-ND
R1-R3 R6 R7 R9-R11 R14-R17 R20 R23 R26 = microbuilder:RESISTOR: Resistors For new designs, use the packages preceded by an '_' character since they are more reliable: The following footprints should be used on most boards: _0402 - Standard footprint for regular board layouts _0603 - Standard footprint for regular board layouts _0805 - Standard footprint for regular board layouts _1206 - Standard footprint for regular board layouts For extremely tight-pitch boards where space is at a premium, the following 'micro-pitch' footprints can be used (smaller pads, no silkscreen outline, etc.): _0402MP - Micro-pitch footprint for very dense/compact boards _0603MP - Micro-pitch footprint for very dense/compact boards _0805MP - Micro-pitch footprint for very dense/compact boards _1206MP - Micro-pitch footprint for very dense/compact boards
R4 R5 R12 R13 = rcl:R-EU_: RESISTOR, European symbol; SPICEPREFIX: R
R8 R18 R19 R21 R22 = rcl:R-EU_: RESISTOR, European symbol
SJ1-SJ3 SJ5 = SparkFun-Retired:SOLDERJUMPER_2WAY-OLD: Solder Jumper 2 way solder jumper
SJ4 = jumper:SJ: SMD solder JUMPER
SJ7 SJ8 = SparkFun-Retired:SOLDERJUMPER: Solder Jumper Standard SMD solder jumper. Used to automate production. Two varients : Normally Open and Normally Closed are the same, but have different paste layers. NC will have a large amount of paste and should jumper during reflow.
U1 = battery-management-temp:BQ27441-G1; PROD_ID: IC-13220
U2 = microbuilder:VREG_SOT23-5: SOT23-5 Fixed Voltage Regulators Part Current Out V Out V In V Dropout θJA (°C/W) TJ (°C) Digikey Part No. ADP121 150mA 3.3V 3.4-5.5V 0.09V @ 150mA -- -- ADP121-AUJZ33R7CT-ND ADP121 150mA 3.0V 3.1-5.5V 0.09V @ 150mA -- -- ADP121-AUJZ30R7CT-ND ADP122 300mA 3.3V 3.4-5.5V 0.085V @ 300mA -- -- ADP122AUJZ-3.3-R7CT-ND ADP1712 300mA 3.3V 3.5-5.5V 0.17V @ 300mA -- -- ADP1712AUJZ-3.3-R7TR-ND AP7311 (Low Cost) 150mA 3.3V 3.5-6V 0.15V @ 150mA -- -- AP7311-33WG-7DICT-ND LD39015M18R 150mA 1.8V 1.9V-5.5V 0.08V @ 100mA -- -- 497-6977-1-ND LP2985A-33DBVR 150mA 3.3V 3.3-16V 0.28V @ 150mA 206 150 296-18479-1-ND MCP1824T-3302E/OT 300mA 3.3V 3.5V-6V 0.2V @ 300mA -- -- MCP1824T-3302E/OTCT-ND MIC5205-2.5YM5 TR 150mA 2.5V 2.7-16V 0.165V @ 150mA -- -- 576-1257-2-ND MIC5205-3.0YM5 TR 150mA 3.0V 3.2V-16V 0.165V @ 150mA -- -- 576-1258-2-ND MIC5205-3.3YM5 TR 150mA 3.3V 3.5V-16V 0.165V @ 150mA -- -- 576-1259-2-ND TPS780330220 150mA 3.3V+2.2V 3.6-5.5V 250mV Max -- -- 296-23332-1-ND TDA3663/N1,135 100mA 3.3V 3.5-45V 0.18V @ 50mA -- -- 568-5343-1-ND Max operating temp can be calculated using θJA, TJ (max junction temperature), and power in watts. Set the "Maximum Ambient Temperature" until it reaches TJ ("Max Junction Temperature"), which is the absolute limit for safe use of the regulator: Heat Sink Temperature Calculator <http://www.daycounter.com/Calculators/Heat-Sink-Temperature-Calculator.phtml> For example, With 12V source into a 3.3V LP2985 and a 30mA load, we are dissipating (12V-3.3V) * 0.03A = 0.261W. With a θJA of 206 °C/W, a TJ of 150°C, and 261mW we can safely use the chip without a heat sink up to 75°C (=147.1°C Junction Temperature).
U3 = microbuilder:BME280: BME280 - Environmental Sensor (I2C + SPI)
U4 = template:MPU-9250
U$2 = buzzer:BUZZER
U$7 = q10keyboard:Q10KEYBOARD
U$10 = LS027B7DH01A:AYF531035_SHARP_MEM_DISP
U$14 = nrf52840mod:NRF52840
U$17 = JST-SH-4:JST-SH-3
U$28 U$41 U$74 = GeekAmmo:N-CHANNEL-MOSFET: N-Channel MOSFET Mode Field Effect Transistor; DATASHEET: http://www.fairchildsemi.com/ds/BS/BSS138.pdf; DIGIKEY: BSS138TR-ND; ELEMENT14: 2323154; URL: http://au.element14.com/fairchild-semiconductor/bss138/mosfet-n-ch-50v-220ma-sot-23/dp/2323154
U$36 = sx1262-EBYTE:SX1292-EBYTE
U$45 = SparkFun-Retired:SWITCH_SPDT: SWCH-10651 Side-actuated SPDT slide switch, as used on the Arduino Pro; PROD_ID: SWCH-10651
U$46 = vibro:VIBRO
U$47 = TP4056andGC5177:TP4056BETTER_TP4056
U$69 = ds3231M:DS3231M
X1 = microbuilder:CON_JST_PH_2PIN: JST 2-Pin Right-Angle Connector PH-Series - 4UConnector: 17311 SH-Series - 4UConnector: 07278
X4 = microbuilder:MICROSD: MicroSD/Transflash Card Holder with SPI pinout 3M: 2908-05WB-MG 4UConnector: 19656 Footprint courtesy: Adafruit Industries

## Net classes
1 power: width 0.254 mm

## Board
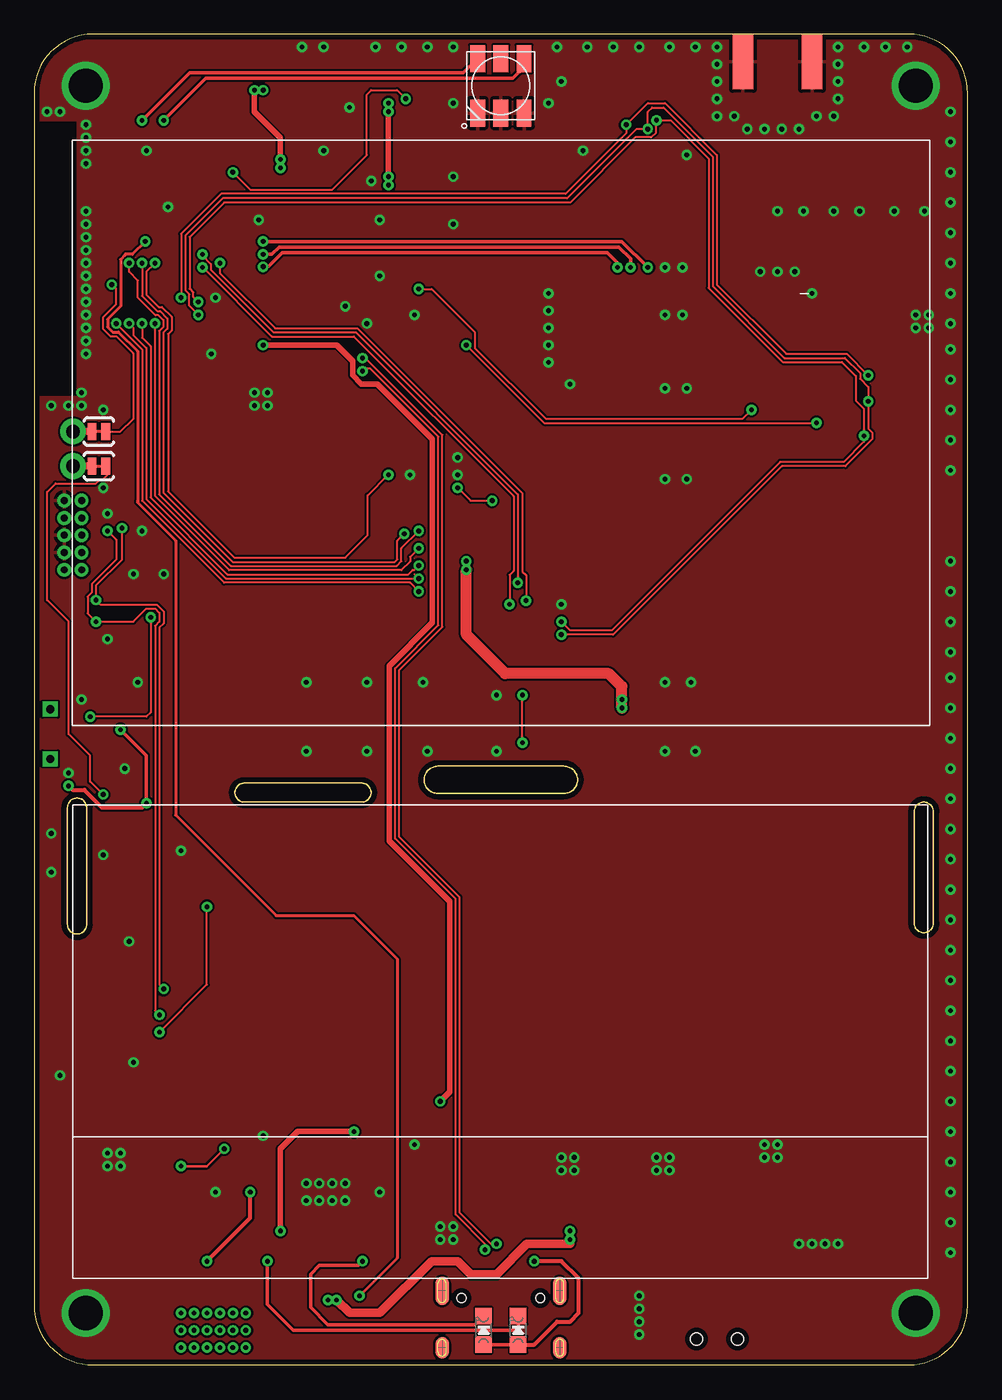
[diagram p3: board, top side]
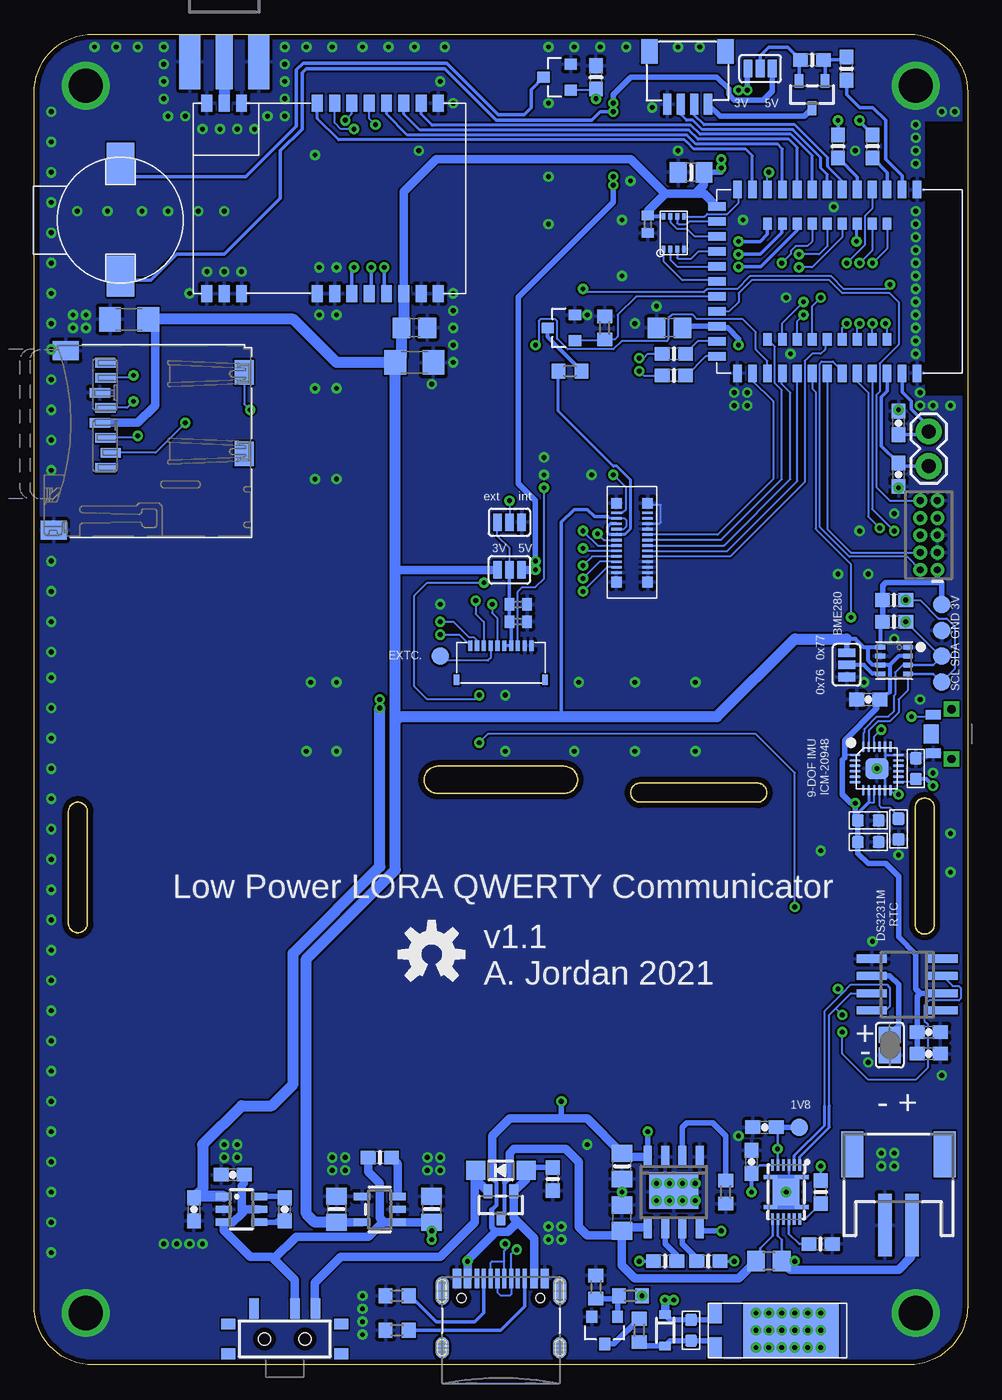
[diagram p4: board, bottom side, seen from below]

Size 68.58 x 97.79 mm. Coordinates in mm from the lower left corner, seen from the top.
Outline: 64.25,97.79 4.32,97.78 arc90 0,93.46 0,4.34 arc90 4.34,0 64.24,0 arc90 68.58,4.34 68.58,93.45 arc90 64.25,97.79
Copper layers (1*16): Top 0.035mm / dielectric 1.5mm / Bottom 0.035mm
Design rules "default *": minimum track width 6mil, minimum drill 0.35mm, track to track 6mil, track to pad 6mil, pad to pad 6mil, via to via 6mil, smd to smd 6mil, copper to edge 15mil, drill to drill 6mil, minimum pad ring 10mil, minimum via ring 8mil, stop-mask expansion 4mil, vias tented up to drill 20mil, thermal gap 10mil

### Footprints (pad centres in the part's own frame; a part is rotated, then mirrored left to right if it is on the bottom)
TP13R = smd 1.3 x 1.3: TP 0,0
SMA_EDGELAUNCH = smd 4.064 x 1.524: GND@1 2.032,-2.54; GND@2 2.032,2.54 | smd 4.064 x 1.524 bottom: GND@3 2.032,2.54; GND@4 2.032,-2.54 | smd 4.064 x 1.27: P 2.032,0
C0805 = smd 1.3 x 1.5: 1 -0.95,0; 2 0.95,0
0603-CAP = smd 1.1 x 1: 1 -0.85,0; 2 0.85,0
C0402 = smd 0.7 x 0.9: 1 -0.65,0; 2 0.65,0
0805-NO = smd 1.24 x 1.5: 1 -0.95,0; 2 0.95,0
C0603 = smd 0.889 x 0.889: 1 0,0.762; 2 0,-0.762
C1206 = smd 1.6 x 1.8: 1 -1.4,0; 2 1.4,0
SOD-123 = smd 1.4 x 1.4: A 1.85,0; C -1.85,0
CHIPLED_0805_NOOUTLINE = smd 1.2 x 1.2: A 0,-1.05; C 0,1.05
SOD-323 = smd 0.63 x 0.83: A 1.15,0; C -1.15,0
LS12T2 = smd 1.1 x 0.7: 1 0,1.4; 2 0,-1.4 | smd 1.1 x 1.4: FRAME -0.15,0 | drill 0.6 pad 1.016 square: P$4 1.35,-1.825; P$5 1.35,1.825
SOT23-6 = smd 0.55 x 1.2: 1 -0.95,-1.3; 2 0,-1.3; 3 0.95,-1.3; 4 0.95,1.3; 5 0,1.3; 6 -0.95,1.3
USON8 = smd 0.5 x 0.275: 1 -1.2,0.75; 2 -1.2,0.25; 3 -1.2,-0.25; 4 -1.2,-0.75; 5 1.2,-0.75; 6 1.2,-0.25; 7 1.2,0.25; 8 1.2,0.75
USB-C-16P = smd 0.3 x 1.45: A5 -1.25,0; A6 -0.25,0; A7 0.25,0; A8 1.25,0; B5 1.75,0; B6 0.75,0; B7 -0.75,0; B8 -1.75,0 | smd 0.6 x 1.45: GND -3.225,0; GND2 3.225,0 | smd 1 x 2.1: SHLD1 -4.32,-0.915; SHLD2 4.32,-0.915 | smd 1 x 2.1 bottom: SHLD3 -4.32,-0.915; SHLD4 4.32,-0.915 | smd 1 x 1.6: SHLD5 -4.32,-5.095; SHLD8 4.32,-5.095 | smd 1 x 1.6 bottom: SHLD6 -4.32,-5.095; SHLD7 4.32,-5.095 | smd 0.55 x 1.45: VBUS1 -2.45,0; VBUS2 2.45,0 | hole 0.65: -2.89,-1.445; 2.89,-1.445
2X5-PTH-1.27MM-NO_SILK = drill 0.508 pad 1: 1 -2.54,-0.635; 2 -2.54,0.635; 3 -1.27,-0.635; 4 -1.27,0.635; 5 0,-0.635; 6 0,0.635; 7 1.27,-0.635; 8 1.27,0.635; 9 2.54,-0.635; 10 2.54,0.635
1X02 = drill 1.016 pad 1.88: 1 0,0; 2 2.54,0
RGBLED5050 = smd 2 x 1.1: 1 -2,1.7; 2 -2,0; 3 -2,-1.7; 4 2,-1.7; 5 2,0; 6 2,1.7
SOT23-R = smd 0.635 x 1.016: 1 -0.95,-1; 2 0.95,-1; 3 0,1
0603-NO = smd 1.075 x 1: 1 -0.85,0; 2 0.85,0
R0603 = smd 1 x 1.1: 1 -0.85,0; 2 0.85,0
R0805 = smd 1.3 x 1.5: 1 -0.95,0; 2 0.95,0
SJ_3 = smd 0.635 x 1.27: 1 -0.889,0; 2 0,0; 3 0.889,0
SJ = smd 1.168 x 1.6: 1 -0.762,0; 2 0.762,0
SJ_2S-TRACE = smd 0.635 x 1.27: 1 -0.508,0; 2 0.508,0
PDSO-N12 = smd 0.2 x 0.85: 1 -1,-1.975; 2 -0.6,-1.975; 3 -0.2,-1.975; 4 0.2,-1.975; 5 0.6,-1.975; 6 1,-1.975; 7 1,1.975; 8 0.6,1.975; 9 0.2,1.975; 10 -0.2,1.975; 11 -0.6,1.975; 12 -1,1.975 | smd 1.95 x 1.95: EP 0,0 | smd 1 x 0.25: EP1 -1.15,1.1; EP2 -1.15,-1.1; EP3 1.15,-1.1; EP4 1.15,1.1
SOT23-5 = smd 0.55 x 1.2: 1 -0.95,-1.3; 2 0,-1.3; 3 0.95,-1.3; 4 0.95,1.3; 5 -0.95,1.3
BME280 = smd 0.7 x 0.35: 1 1.025,0.975; 2 1.025,0.325; 3 1.025,-0.325; 4 1.025,-0.975; 5 -1.025,-0.975; 6 -1.025,-0.325; 7 -1.025,0.325; 8 -1.025,0.975
LEAD-QFN24 = smd 0.8 x 0.2: 1 -1.6,1; 2 -1.6,0.6; 3 -1.6,0.2; 4 -1.6,-0.2; 5 -1.6,-0.6; 6 -1.6,-1; 13 1.6,-1; 14 1.6,-0.6; 15 1.6,-0.2; 16 1.6,0.2; 17 1.6,0.6; 18 1.6,1 | smd 0.2 x 0.8: 7 -1,-1.6; 8 -0.6,-1.6; 9 -0.2,-1.6; 10 0.2,-1.6; 11 0.6,-1.6; 12 1,-1.6; 19 1,1.6; 20 0.6,1.6; 21 0.2,1.6; 22 -0.2,1.6; 23 -0.6,1.6; 24 -1,1.6 | smd 1.7 x 1.54: 25 0,0
BUZZER = smd 3 x 2: P$1 0,0; P$2 8.3,0
Q10KEYBOARD = smd 0.8 x 0.8 bottom: 1 20.66,56.96; 2 20.66,51.16; 3 22.94,51.16; 4 22.94,56.96 | smd 0.8 x 0.2 bottom: P1 20.66,56.26; P2 20.66,55.86; P3 20.66,55.46; P4 20.66,55.06; P5 20.66,54.66; P6 20.66,54.26; P7 20.66,53.86; P8 20.66,53.46; P9 20.66,53.06; P10 20.66,52.66; P11 20.66,52.26; P12 20.66,51.86; P13 22.94,51.86; P14 22.94,52.26; P15 22.94,52.66; P16 22.94,53.06; P17 22.94,53.46; P18 22.94,53.86; P19 22.94,54.26; P20 22.94,54.66; P21 22.94,55.06; P22 22.94,55.46; P23 22.94,55.86; P24 22.94,56.26
AYF531035_Y5BW = smd 0.3 x 0.8 bottom: 1 2.25,5.85; 2 1.75,5.85; 3 1.25,5.85; 4 0.75,5.85; 5 0.25,5.85; 6 -0.25,5.85; 7 -0.75,5.85; 8 -1.25,5.85; 9 -1.75,5.85; 10 -2.25,5.85 | smd 0.4 x 0.8 bottom: P$11 3.25,3.35; P$12 -3.25,3.35
NRF52840MOD = smd 1.27 x 0.635: 1 0,14.7; 2 0,13.6; 3 0,12.5; 4 0,11.4; 5 0,10.3; 6 0,9.2; 7 0,8.1; 8 0,7; 9 0,5.9; 10 0,4.8; 11 0,3.7; 12 0,2.6; 13 0,1.5; 32 13.5,14.7; 33 13.5,13.6; 34 13.5,12.5; 35 13.5,11.4; 36 13.5,10.3; 37 13.5,9.2; 38 13.5,8.1; 39 13.5,7; 40 13.5,5.9; 41 13.5,4.8; 42 13.5,3.7; 43 13.5,2.6; 44 13.5,1.5; P$7 0,8.1; P$32 13.5,8.1 | smd 0.9 x 0.635: 14 2.5,12.5; 15 2.5,11.4; 16 2.5,10.3; 17 2.5,9.2; 18 2.5,8.1; 19 2.5,7; 20 2.5,5.9; 21 2.5,4.8; 22 2.5,3.7; 23 11,12.5; 24 11,11.4; 25 11,10.3; 26 11,9.2; 27 11,8.1; 28 11,7; 29 11,5.9; 30 11,4.8; 31 11,3.7 | smd 0.635 x 1.27: 45 12.25,0; 46 11.15,0; 47 10.05,0; 48 8.95,0; 49 7.85,0; 50 6.75,0; 51 5.65,0; 52 4.55,0; 53 3.45,0; 54 2.35,0; 55 1.25,0
JST-SH-3 = smd 0.6 x 1.55: 1 1.3,3.875; 2 2.3,3.875; 3 3.3,3.875; 4 4.3,3.875 | smd 1.2 x 1.8: HL 5.6,0; HR 0,0
SOT23-3 = smd 0.8 x 0.9: 1 -0.95,-1; 2 0.95,-1; 3 0,1
SX1262_EBYTE = smd 1.27 x 0.8: 1 14,0; 2 14,1.27; 3 14,2.54; 4 14,8.11; 5 14,9.38; 6 14,10.65; 7 14,11.92; 8 14,13.19; 9 14,14.46; 10 14,15.73; 11 14,17; 12 0,17; 13 0,15.73; 14 0,14.46; 15 0,13.19; 16 0,11.92; 17 0,10.65; 18 0,9.38; 19 0,8.11; 20 0,2.54; 21 0,1.27; 22 0,0
KPS-1290 = smd 0.7 x 1.5: O -2.25,2.25; P 0.75,2.25; S 2.25,2.25 | smd 1 x 0.8: P$1 -4.15,1.1; P$2 -4.15,-1.1; P$3 4.15,-1.1; P$4 4.15,1.1 | hole 0.9: -1.5,0; 1.5,0
VIBRO = smd 1 x 1.5: + -4.6,1.25; - -4.6,-1.25 | smd 7 x 4: PLANE 1,0
TP4056BETTER_SO-08 = smd 0.6 x 1.6: 1 -1.905,-2.6; 2 -0.635,-2.6; 3 0.635,-2.6; 4 1.905,-2.6; 5 1.905,2.6; 6 0.635,2.6; 7 -0.635,2.6; 8 -1.905,2.6 | smd 3.6 x 2.5: P$1 0,0
SO8 = smd 0.6 x 2.2: 1 -1.905,-2.6; 2 -0.635,-2.6; 3 0.635,-2.6; 4 1.905,-2.6; 5 1.905,2.6; 6 0.635,2.6; 7 -0.635,2.6; 8 -1.905,2.6
JSTPH2 = smd 1 x 4.6: 1 -1,-3.7; 2 1,-3.7 | smd 1.6 x 3.4: NC1 -3.4,1.5; NC2 3.4,1.5
MICROSD = smd 0.7 x 1.5: 1 9,-10.64; 2 7.9,-10.24; 3 6.8,-10.64; 4 5.7,-11.04; 5 4.6,-10.64; 6 3.5,-11.04; 7 2.4,-10.64; 8 1.3,-10.64 | smd 1.8 x 1.4: CD1 2,-0.44; CD2 8,-0.44 | smd 1.4 x 1.9: MT1 0.4,-13.54; MT2 13.6,-14.44

### Placement (x,y rotation side)
1V8  12.38,17.46 0 bottom
3V  1.91,55.88 0 bottom
ANT  54.61,97.79 270 bottom
C1  25.4,10.79 90 bottom
C2  50.16,11.43 90 bottom
C3  33.02,55.88 0 bottom
C4  14.92,17.46 180 bottom
C5  15.88,14.92 90 bottom
C6  46.35,11.43 270 bottom
C7  39.37,11.43 270 bottom
C8  20.32,87.63 0 bottom
C9  21.91,76.2 180 bottom
C10  25.4,14.61 90 bottom
C11  53.98,13.97 0 bottom
C12  3.81,43.81 180 bottom
C13  33.02,54.61 0 bottom
C14  5.08,69.22 90 bottom
C15  23.5,83.82 270 bottom
C16  20.32,2.54 180 bottom
C17  56.83,11.43 90 bottom
C18  5.08,39.37 0 bottom
C19  5.08,65.41 270 bottom
C20  61.59,76.83 180 bottom
C21  40.64,73.66 0 bottom
C22  7.3,48.9 180 bottom
C23  40.64,76.2 0 bottom
C24  7.3,40.01 270 bottom
C25  7.3,38.42 270 bottom
C26  2.86,22.86 0 bottom
C27  2.86,24.45 0 bottom
D1  34.29,14.29 0 bottom
D3  33.02,2.54 0 top
D5  35.56,2.54 0 top
D6  22.23,2.54 270 bottom
DWN2  2.54,46.35 0 bottom
EXTC.  38.73,52.07 0 bottom
GND  1.91,53.98 0 bottom
IC1  53.34,11.43 270 bottom
IC2  21.59,83.19 90 bottom
J2  34.29,6.35 0 bottom
J3  2.86,60.96 90 bottom
JP2  2.86,68.58 270 bottom
LED1  34.29,93.98 270 top
Q2  11.43,93.34 180 bottom
Q3  34.29,11.75 180 bottom
R1  11.43,95.89 0 bottom
R2  30.48,13.65 90 bottom
R3  19.05,7.62 180 bottom
R4  17.78,12.7 90 bottom
R5  14.61,7.62 180 bottom
R6  5.4,56.2 180 bottom
R7  22.23,7.62 0 bottom
R8  27.3,5.71 270 bottom
R9  5.4,54.61 180 bottom
R10  10.79,12.7 90 bottom
R11  10.79,8.89 180 bottom
R12  41.91,2.54 0 bottom
R13  41.91,5.08 0 bottom
R14  21.59,72.71 0 bottom
R15  21.59,74.3 0 bottom
R16  9.53,89.53 270 bottom
R17  6.99,89.53 270 bottom
R18  24.13,2.54 270 bottom
R19  24.77,5.08 0 bottom
R20  43.18,15.24 0 bottom
R21  29.21,73.03 0 bottom
R22  26.67,76.2 270 bottom
R23  27.3,94.61 270 bottom
R26  8.89,95.25 90 bottom
SCL  1.91,50.16 0 bottom
SDA  1.91,52.07 0 bottom
SJ1  15.24,95.25 0 bottom
SJ2  8.89,51.44 90 bottom
SJ3  33.66,58.42 0 bottom
SJ4  5.71,23.5 90 bottom
SJ5  33.66,61.91 180 bottom
SJ7  4.76,68.58 180 top
SJ8  4.76,66.04 0 top
U1  13.34,12.7 180 bottom
U2  43.18,11.43 90 bottom
U3  5.4,51.75 0 bottom
U4  6.67,43.81 0 bottom
U$2  62.23,80.01 90 bottom
U$7  2.86,6.35 0 top
U$10  34.29,46.99 0 top
U$14  18.41,86.36 270 bottom
U$17  17.78,96.52 180 bottom
U$28  29.84,76.2 90 bottom
U$36  55.88,92.71 270 bottom
U$41  26.67,2.54 180 bottom
U$45  50.16,1.91 0 bottom
U$46  13.97,2.54 0 bottom
U$47  21.59,12.7 180 bottom
U$69  4.45,27.94 90 bottom
U$74  30.16,94.61 90 bottom
U$77  [OSHW-LOGO-M]  39.37,30.16 0 bottom
X1  5.08,13.97 0 bottom
X4  52.7,74.93 270 bottom

### Tracks (layer width: path | path; a pad name or v marks a point on that pad's centre or on a via)
1.8V  (via drill 0.35)
  Top 0.2: v10.79,14.61 12.7,14.61 v13.97,15.88
  Bottom 0.2: R10.2 v10.79,14.61 | U1.5 13.94,15.84 v13.97,15.88 13.97,17.36 14.02,17.41 C4.1
  Bottom 0.406: 1V8.TP 13.97,17.46 14.02,17.41
3.3V  (via drill 0.35)
  Top 0.254: v6.35,46.67 8.26,44.77 v8.26,41.27
  Top 0.305: v2.54,42.55 2.84,42.25 3.7,42.25 4.99,40.96 7.94,40.96 v8.26,41.27
  Top 0.406: v16.19,93.66 16.19,92.08 18.1,90.17 v18.1,88.58
  Bottom 0.152: U$7.P21 25.27,61.41 25.08,61.59 25.08,62.08 25.21,62.21 U$7.P23 25.78,62.23 | C12.1 4.05,42.81 U4.13 | 8.06,40.51 C24.2 8.26,40.2 | U4.22 6.87,46.16 v6.35,46.67 | U4.1 8.84,44.81 9.05,44.61 9.21,44.45 | 8.57,41.27 v8.26,41.27 | 7.27,41.31 6.87,41.31 U4.9
  Bottom 0.2: U$7.P23 26.32,62.21 26.42,62.32
  Bottom 0.203: U4.8 7.27,41.31
  Bottom 0.254: 34.61,58.48 SJ3.1 | 26.42,62.32 27.39,62.32 27.94,62.87 28.89,62.87 29.84,61.91 29.84,47.62 | 7.27,41.31 8.06,40.51
  Bottom 0.305: IC2.8 23.41,84.39 C15.1 | R9.2 6.42,54.44 U3.8 7.3,52.73 | 7.3,52.73 7.64,52.73 8.26,53.34 8.89,53.34 | 7.3,52.73 7.3,51.75 6.99,51.44 U3.6 5.72,51.43 | U3.2 5.07,52.08 5.72,51.43 | 5.72,51.43 5.72,49.42 C22.1 | v2.54,42.55 2.81,42.81 2.82,42.81 3.06,43.05 C12.1
  Bottom 0.406: 8.89,53.34 SJ2.3 | R9.2 R6.2 6.25,57.25 6.03,57.47 2.22,57.47 | 3V.TP 1.91,57.47 2.22,57.47 | SJ1.1 16.19,95.19 v16.19,93.66 v16.83,93.66 | C8.2 18.1,87.63 v18.1,88.58 v18.1,87.95 | J3.1 2.22,57.47 | v8.26,41.27 8.26,40.2 | 9.21,44.45 9.21,41.91 8.57,41.27 | C24.2 C25.2 8.06,37.59 7.3,36.83 6.03,36.83 5.08,35.88 5.08,31.43 3.81,30.16 3.81,27.62 3.49,27.3 | C22.1 6.67,48.68 6.67,48.26 9.05,45.88 9.05,44.61 | U$69.2 3.49,27.3 | 3.49,27.3 3.71,27.09 C27.1 C26.1
  Bottom 0.61: U2.5 C6.2 | X4.4 60.95,69.23 59.69,70.48 59.69,76.33 C20.1 | SJ3.1 42.04,58.42 | C15.1 23.5,84.77 22.23,86.04 | 22.23,86.04 20,86.04 | 20,86.04 19.37,86.67 C8.2 | U$14.55 19.35,86.04 20,86.04 | U$36.9 41.42,86.22 39.05,88.58 24.77,88.58 22.23,86.04
  Bottom 0.813: C6.2 47.95,10.48 48.58,11.11 48.58,29.84 42.04,36.38 42.04,47.31 | 42.04,47.31 42.04,58.42 C21.1 | U$36.9 41.42,76.37 C23.1 41.59,74.11 C21.1 | C21.1 46.35,73.66 49.53,76.83 C20.1 | 42.04,47.31 41.72,47.62 29.84,47.62 18.41,47.62 12.7,53.34 8.89,53.34
5.0V  (via drill 0.35)
  Top 0.406: v26.04,92.08 v26.04,87.31
  Top 0.813: v43.18,48.26 43.18,49.85 42.23,50.8 34.61,50.8 31.75,53.66 v31.75,58.42
  Bottom 0.254: v26.04,92.08 26.99,92.08 27.6,91.47 34.63,91.47 38.42,95.25 48.58,95.25 48.9,94.93 48.9,90.81 50.48,89.22 50.48,85.72 54.61,81.6 58.1,81.6 60.01,79.69 61.91,79.69 U$2.P$1
  Bottom 0.406: SJ1.3 14.35,93.6 15.02,92.93 17.13,92.93 17.56,93.36 17.56,93.76 18.41,94.61 24.77,94.61 26.04,93.34 v26.04,92.08 v26.04,92.71 | v26.04,86.68 v26.04,87.31 26.04,85.45 33.02,78.46 33.02,64.77 31.75,63.5 v31.75,58.42 v31.75,59.05 | v43.18,48.9 v43.18,48.26 | 56.73,12.38 C17.2
  Bottom 0.61: v31.75,58.42 SJ3.3
  Bottom 0.813: v43.18,48.26 43.18,36.61 49.54,30.25 49.54,20.62 51.12,19.05 53.34,19.05 56.2,16.19 56.2,12.91 56.73,12.38 IC1.1
BATTERY_IN  (via drill 0.35)
  Top 0.305: v12.7,7.62 15.88,10.79 v15.88,12.7
  Bottom 0.2: U1.8 13.94,9.49 13.65,9.21 R5.1 | U1.6 15.27,14.68 C5.1
  Bottom 0.305: 12.7,6.99 v12.7,7.62 | v15.88,12.7 C5.1
  Bottom 0.61: X1.2 4.13,10.86 4.13,7.94 5.08,6.99 12.7,6.99 13.02,6.99 R5.1
BUSY
  Bottom 0.203: U$14.9 12.52,89.43 13.14,90.06 19.81,90.06 20.48,90.73 40.25,90.73 41.42,91.9 U$36.14
BUZ  (via drill 0.35)
  Top 0.152: v14.61,87.63 15.88,86.36 21.91,86.36 24.45,88.9 24.45,93.34 24.77,93.66 26.67,93.66 v27.3,93.03
  Bottom 0.152: U$14.11 14.71,87.52 v14.61,87.63 | v27.3,93.03 R23.2 27.41,93.67 U$74.1
CC1
  Bottom 0.254: J2.A5 35.56,6.33 35.56,3.81 36.2,3.17 39.05,3.17 40.96,5.08 R13.2
CC2
  Bottom 0.254: J2.B5 32.54,4.29 34.29,2.54 R12.2
COL1
  Bottom 0.152: U$7.P6 18.13,60.61 13.65,65.09 13.65,71.62 14.16,72.13 14.16,74.81 U$14.31
COL2
  Bottom 0.152: U$7.P8 17.66,59.81 12.52,64.95 U$14.40
COL3
  Bottom 0.152: U$7.P9 17.43,59.41 11.97,64.87 11.97,73.76 11.43,74.3 10.79,74.3 10.48,74.61 10.48,75.2 U$14.27
COL4  (via drill 0.35)
  Top 0.152: v6.03,76.52 7.94,74.61 7.94,63.5 13.97,57.47 27.62,57.47 v28.26,56.83
  Bottom 0.152: U$14.23 5.92,76.4 v6.03,76.52 | U$7.P14 26.48,58.61 v28.26,56.83
COL5  (via drill 0.35)
  Top 0.152: v7.94,76.52 7.94,75.47 8.56,74.85 8.56,63.74 14.21,58.09 27.5,58.09 27.81,58.41 27.93,58.41 v28.26,58.74
  Bottom 0.152: U$14.25 8.12,76.34 v7.94,76.52 | U$7.P16 27.59,59.41 v28.26,58.74
D_CS  (via drill 0.35)
  Top 0.152: v13.65,80.96 13.65,80.24 17.71,76.17 23.75,76.17 35.88,64.05 35.88,58.3 36.14,58.04 v36.14,56.15
  Bottom 0.152: U$14.19 11.43,83.84 11.43,82.55 11.78,82.2 12.63,82.2 12.99,81.85 12.99,81.63 v13.65,80.96 | v36.14,56.15 36.14,55.19 35.54,54.59 U$10.3
DIO1
  Bottom 0.203: U$14.8 11.41,88.83 12.99,90.41 19.66,90.41 20.34,91.08 39.33,91.08 40.15,91.9 U$36.13
DIO2  (via drill 0.35)
  Top 0.254: v16.83,80.69 17.19,80.69 18.24,81.74 42.09,81.74 42.86,80.96 v42.86,80.64
  Bottom 0.254: U$14.20 12.52,83.37 15.2,80.69 v16.83,80.69 | v42.86,80.64 42.86,78.88 U$36.8
DISP  (via drill 0.35)
  Top 0.152: v12.38,80.64 17.46,75.56 23.5,75.56 35.23,63.83 35.23,58.34 34.92,58.04 v34.92,55.88
  Bottom 0.152: U$14.17 9.21,82.86 11.43,80.64 v12.38,80.64 | v34.92,55.88 34.92,55.24 34.54,54.86 U$10.5
EXTCOMIN
  Bottom 0.152: 34.98,52.9 U$10.4 35.04,51.95 35.24,51.75 38.42,51.75 EXTC..TP
GND  (via drill 0.35, 2.5)
  Bottom 0.152: U1.EP1 12.23,11.6 U1.EP | U1.EP4 14.44,11.6 U1.EP | U1.EP3 14.44,13.8 U1.EP | U1.EP2 12.23,13.8 U1.EP | U1.3 13.13,12.9 U1.EP | U$7.P3 22.64,61.81 22.54,61.91 22.54,63.18 23.39,63.18 U$7.1 | U4.20 6.07,44.77 | 6.07,44.77 6.07,44.41 U4.25 | U4.11 6.07,43.22 U4.25 | 6.87,43.62 U4.25 | U4.18 5.12,44.77 6.07,44.77
  other vias: 3.81,79.06 3.81,3.81 64.77,3.81 3.81,93.98 64.77,93.98 20,13.34 20.95,13.34 21.91,13.34 22.86,13.34 20,12.06 20.95,12.06 21.91,12.06 22.86,12.06 13.34,12.7 0.95,92.08 1.91,92.08 3.81,91.12 3.81,90.17 3.81,89.22 3.81,88.27 3.81,84.77 3.81,83.82 3.81,82.87 3.81,81.92 3.81,80.96 3.81,80.01 3.81,78.11 3.81,77.15 3.81,76.2 3.81,75.25 3.81,74.3 3.49,71.44 3.49,70.48 2.54,70.48 1.27,70.48 5.08,70.17 5.08,64.45 50.16,96.84 50.16,95.57 50.16,94.3 50.16,93.03 50.16,91.76 51.44,91.76 52.39,90.81 53.66,90.81 54.93,90.81 56.2,90.81 57.47,91.76 58.74,91.76 59.05,96.84 59.05,95.57 59.05,94.3 59.05,93.03 64.77,77.15 64.77,76.2 65.72,77.15 65.72,76.2 53.66,15.24 54.61,15.24 54.61,16.19 53.66,16.19 57.15,8.89 56.2,8.89 59.05,8.89 58.1,8.89 45.72,14.29 46.67,14.29 46.67,15.24 45.72,15.24 38.73,15.24 39.69,15.24 39.69,14.29 38.73,14.29 5.4,15.56 6.35,15.56 6.35,14.61 5.4,14.61 16.19,71.44 16.19,70.48 17.14,70.48 17.14,71.44 38.73,94.3 37.78,92.71 37.78,78.74 37.78,77.47 37.78,76.2 37.78,74.93 37.78,73.66 39.37,72.07 46.35,77.15 47.62,77.15 46.35,80.64 47.62,80.64 53.34,80.33 54.61,80.33 55.88,80.33 57.15,78.74 25.4,12.7 16.83,16.83 23.18,92.39 5.4,53.34 3.49,48.9 27.94,77.15 21.27,89.22 30.8,92.71 40.32,89.22 30.8,87.31 30.8,83.82 7.62,50.16 31.11,66.67 31.11,65.41 6.67,43.81 2.54,43.5 20,50.16 24.45,50.16 20,45.09 24.45,45.09 28.57,50.16 28.89,45.09 33.97,49.21 33.97,45.09 46.35,50.16 46.35,45.09 13.34,78.42 9.84,85.09 16.51,84.14 27.62,65.41 7.94,61.28 10.79,37.78 24.77,87 54.61,84.77 56.52,84.77 58.74,84.77 60.64,84.77 63.18,84.77 65.41,84.77 48.58,96.84 46.67,96.84 44.45,96.84 42.55,96.84 40.64,96.84 38.42,96.84 60.96,96.84 62.55,96.84 64.14,96.84 30.8,96.84 28.89,96.84 26.99,96.84 25.08,96.84 21.27,96.84 19.68,96.84 22.86,77.79 24.45,76.52 67.31,92.08 67.31,89.85 67.31,87.63 67.31,85.41 5.4,62.55 8.26,89.22 67.31,65.72 67.31,83.19 67.31,80.96 67.31,78.74 67.31,76.52 67.31,74.61 67.31,72.39 67.31,70.17 67.31,67.94 67.31,59.05 67.31,56.83 67.31,54.61 67.31,52.39 67.31,50.48 67.31,48.26 67.31,46.04 67.31,43.81 67.31,41.59 67.31,39.37 67.31,37.15 67.31,34.92 67.31,32.7 67.31,30.48 67.31,28.26 67.31,26.04 67.31,23.81 67.31,21.59 67.31,19.37 67.31,17.14 67.31,14.92 67.31,12.7 67.31,10.48 67.31,8.26 29.84,10.16 29.84,9.21 30.8,9.21 30.8,10.16 44.45,5.08 44.45,4.13 44.45,3.17 44.45,2.22 46.35,71.75 47.94,71.75 46.35,65.09 47.94,65.09 48.26,50.16 48.58,45.09 9.53,58.1 7.3,58.1 1.27,39.05 1.27,36.2 25.4,84.14 25.4,80.01 47.94,88.9 13.02,74.3 7.3,22.23 1.91,21.27 6.99,31.11 5.08,37.47 27.94,16.19 38.73,55.88
  pour Top: -1.27,71.12 -1.27,-1.27 71.12,-1.27 71.12,99.06 -1.27,99.06 -1.27,91.44 3.17,91.44 3.17,71.12
  pour Bottom: -2.54,-2.54 -2.54,71.12 3.17,71.12 3.17,91.44 -2.54,91.44 -2.54,100.33 72.39,100.33 72.39,-2.54
GPOUT
  Bottom 0.2: R10.1 11.92,10.72 U1.12
GPS_ON
  Bottom 0.254: U$14.2 4.82,87.36 6.03,88.58 6.03,91.44 6.99,92.39 7.94,92.39 8.89,93.34 R26.1
K_BLT
  Bottom 0.152: U$14.49 24.36,78.51 25.72,77.15 25.72,75.56 25.93,75.35 R22.2 26.77,75.25 U$28.1
L_RST
  Bottom 0.203: U$14.10 13.62,89.34 13.97,89.7 19.96,89.7 20.63,90.37 20.64,90.37 41.16,90.37 42.69,91.9 U$36.15
L_SS
  Bottom 0.203: U$14.12 15.81,88.84 16.32,89.34 20.1,89.34 20.61,89.85 20.64,89.85 20.8,90.02 46.2,90.02 47.77,91.58 U$36.19
LED1
  Bottom 0.254: U$14.5 8.12,87.28 R16.2
LED2
  Bottom 0.254: U$14.3 5.92,87.61 R17.2
MISO  (via drill 0.35)
  Top 0.152: v61.28,72.71 59.69,74.3 55.24,74.3 50.16,79.38 50.16,88.9 46.35,92.71 45.09,92.71 v43.5,91.12 43.5,90.49 39.05,86.04 13.74,86.04 10.81,83.11 10.81,78.44 v10.79,78.42
  Bottom 0.152: U$14.28 11.41,77.8 v10.79,78.42 | v43.5,91.12 43.96,91.58 U$36.16 | v61.28,72.71 61.45,72.53 X4.7
MOSI  (via drill 0.35)
  Top 0.152: v12.06,78.11 11.71,78.46 11.71,78.8 11.43,79.08 11.43,82.87 13.97,85.41 39.37,85.41 44.16,90.2 45.34,90.2 45.69,90.55 45.69,91.12 | v45.73,91.45 45.69,91.41 45.69,91.12 | 45.69,91.12 46.01,91.44 46.76,91.44 49.55,88.65 49.55,79.12 54.99,73.69 59.35,73.69 60.37,72.67 60.37,70.86 60.96,70.26 v60.96,68.26 60.96,67.83 59.47,66.34 54.8,66.34 42.43,53.98 39.37,53.98 v38.73,54.61
  Bottom 0.152: U$14.30 13.62,76.56 v12.06,78.11 | v45.73,91.45 45.23,91.94 U$36.17 | v60.96,68.26 61.09,68.13 X4.3 | v38.73,54.61 37.78,54.61 36.64,53.47 36.3,53.47 36.04,53.21 U$10.2
MOT  (via drill 0.35)
  Top 0.203: v8.17,82.55 7.21,81.6 6.67,81.6 6.67,81.54 6.35,81.22 6.35,77.79 5.4,76.83 5.4,76.26 5.77,75.89 6.2,75.89 7.61,74.48 7.61,63.5 7.61,63.36 10.4,60.57 10.4,40.4 17.78,33.02 23.5,33.02 26.67,29.84 26.67,7.83 R19.2
  Bottom 0.203: U$14.16 8.17,83.81 v8.17,82.55
  other vias: 23.91,5.08
MOTOR
  Bottom 0.406: U$41.1 25.72,4.97 R19.1 25.83,4.87 R8.2
MPU_INT  (via drill 0.35)
  Top 0.152: v5.08,41.91 4.13,42.86 4.13,44.77 2.54,46.35 2.54,54.61 0.95,56.2 0.95,64.14 1.59,64.77 4.54,64.77 4.83,65.06 5.05,65.06 5.4,65.41 5.24,65.56 | 5.24,65.56 5.21,65.59 | SJ8.2 5.24,66.01 5.24,65.56
  Bottom 0.152: U4.12 5.36,41.91 v5.08,41.91
N$1
  Bottom 0.406: R3.2 19.9,7.83 20.95,8.89 U$47.7
N$2
  Bottom 0.406: C2.2 50.27,12.38 IC1.6
N$3
  Bottom 0.406: IC1.4 50.78,10.48 50.68,10.58 C2.1
N$4
  Bottom 0.61: Q3.2 36.14,13.65 D1.C 36.2,14.23 36.2,10.48 38.73,7.94 46.04,7.94 47.94,6.03 47.94,4.18 U$45.S
N$5
  Bottom 0.254: R26.2 9.11,95.89 R1.2 10.48,95.78 Q2.1
N$6
  Bottom 0.152: U$14.45 19.23,74.11 20.64,72.71 R14.2
N$7
  Bottom 0.152: U$14.46 19.82,75.21 R15.2
N$8
  Bottom 0.406: R7.2 21.38,8.04 22.23,8.89 U$47.6
N$9
  Bottom 0.406: U$41.3 25.98,1.54 R18.1
N$10
  Bottom 0.406: U$46.- 19.06,1.78 C16.1 21.84,1.78 D6.A 23.83,1.39 R18.2
N$11  (via drill 0.35)
  Top 0.254: v17.14,7.62 17.14,4.45 19.05,2.54 35.24,2.54 35.56,2.86 D5.C
  Bottom 0.254: R3.1 v17.14,7.62
N$12  (via drill 0.35)
  Top 0.254: D3.C 32.38,2.95 21.59,2.95 20.32,4.22 20.32,6.67 20.95,7.3 23.81,7.3 v24.13,7.62
  Bottom 0.254: v24.13,7.62 R7.1
N$13  (via drill 0.35)
  Top 0.254: v9.53,91.44 12.61,94.53 35.15,94.53 35.99,95.36 LED1.1
  Bottom 0.254: R16.1 v9.53,91.44
N$14  (via drill 0.35)
  other vias: 15.56,3.81
N$15
  Bottom 0.406: Q2.3 12.02,91.76 18.19,91.76 U$17.1
N$17
  Bottom 0.203: U$7.P22 26.26,61.81 26.45,61.62 26.45,61.17 26.29,61.01 U$7.P20 25.75,61.06 25.16,61.06 24.75,61.46 24.75,65.02 25.77,66.04 26.03,66.04 30.06,70.06 R21.1
N$18
  Bottom 0.254: Q2.2 12.38,95.78 R1.1 13.23,96.84 14.61,96.84 15.24,96.2 SJ1.2
N$19
  Bottom 0.305: R21.2 30.84,75.51 U$28.3
N$20
  Bottom 0.813: ANT.P U$36.21
N$21  (via drill 0.35)
  Top 0.254: v7.94,91.44 11.43,94.93 31.54,94.93 LED1.3
  Bottom 0.254: R17.1 7.94,91.34 v7.94,91.44
N$22  (via drill 0.35)
  other vias: 15.56,1.27
N$23  (via drill 0.35)
  other vias: 14.61,1.27
N$24  (via drill 0.35)
  other vias: 13.65,1.27
N$25
  Bottom 0.305: U3.5 6.45,50.8 7,50.8 7.63,51.44 SJ2.2
N$26  (via drill 0.35)
  other vias: 14.61,3.81
N$27  (via drill 0.35)
  other vias: 13.65,3.81
N$28  (via drill 0.35)
  other vias: 12.7,3.81
N$29  (via drill 0.35)
  other vias: 11.75,3.81
N$30
  Bottom 0.254: U$74.3 32.07,93.71 32.07,92.39 32.59,91.87 34.47,91.87 38.25,95.66 48.81,95.66 49.3,95.16 49.3,91.03 53.02,87.31 61.23,87.31 U$2.P$2
N$31  (via drill 0.35)
  other vias: 10.79,3.81
N$32  (via drill 0.35)
  other vias: 12.7,1.27
N$33  (via drill 0.35)
  other vias: 11.75,1.27
N$34  (via drill 0.35)
  other vias: 10.79,1.27
N$35  (via drill 0.35)
  other vias: 15.56,2.54
N$36  (via drill 0.35)
  other vias: 14.61,2.54
N$37  (via drill 0.35)
  other vias: 13.65,2.54
N$38  (via drill 0.35)
  other vias: 12.7,2.54
N$39  (via drill 0.35)
  other vias: 11.75,2.54
N$40  (via drill 0.35)
  other vias: 10.79,2.54
N$41
  Bottom 0.152: C18.1 5.4,40.45 5.4,40.64 5.71,40.96 6.35,40.96 6.47,41.08 U4.10
N$43
  Bottom 0.406: SJ4.2 5.08,24.89 5.08,27.94 5.71,28.57 U$69.6
N$44
  Bottom 0.152: SJ5.3 34.54,60.9 33.66,60.01 SJ3.2
  Bottom 0.254: SJ3.2 33.67,58.41 C3.1 C13.1 33.54,54.48 U$10.7 U$10.6
N$45  (via drill 0.35)
  Top 0.152: v31.11,64.45 32.07,63.5 v33.66,63.5
  Bottom 0.152: U$10.8 33.04,56.81 32.7,57.15 31.75,57.15 31.11,57.78 v31.11,64.45 | v33.66,63.5 SJ5.2
NFC1
  Top 0.508: SJ8.1 JP2.2
  Bottom 0.254: JP2.2 4.87,66.04 C19.1 6.35,67.53 6.35,71.12 5.92,71.56 U$14.34
NFC2
  Top 0.508: SJ7.2 JP2.1
  Bottom 0.254: U$14.33 4.82,71.49 4.13,70.8 4.13,70.78 4.15,70.76 4.15,70.21 2.54,68.6 JP2.1 2.75,68.36 C14.1
NRF_RST
  Bottom 0.152: U$14.48 17.52,77.41 16.83,78.11 16.83,78.74 15.88,79.69 10.16,79.69 9.21,78.74 5.71,78.74 5.08,78.11 5.08,74.97 6.46,73.59 6.46,71.51 6.71,71.27 6.71,64.49 5.71,63.5 J3.10
PHOLD
  Bottom 0.61: U2.3 41.88,14.79 R20.2
PRG
  Bottom 0.406: R4.2 17.78,16.83 18.73,17.78 20.64,17.78 20.95,17.46 U$47.2
QSPI_CS
  Bottom 0.152: U$14.50 18.5,79.69 20.95,79.69 22.34,81.08 IC2.1
QSPI_DATA0
  Bottom 0.152: IC2.5 19.32,84.39 19.14,84.56 17.68,84.56 16.83,85.41 16.83,86.27 U$14.13
QSPI_DATA1
  Bottom 0.152: U$14.51 21.34,80.71 21.84,81.21 IC2.2
QSPI_DATA2
  Bottom 0.152: U$14.52 19.79,81.81 20.32,81.28 21.27,81.28 21.34,81.35 IC2.3
QSPI_DATA3
  Bottom 0.152: U$14.53 20.05,82.91 20.64,83.5 21.39,83.5 21.84,83.96 IC2.7
QSPI_SCK
  Bottom 0.152: U$14.54 20.45,84.01 20.64,83.82 21.27,83.82 21.34,83.89 IC2.6
ROW1
  Bottom 0.152: U$14.43 15.81,72.33 14.29,70.8 14.29,65.09 18.36,61.01 U$7.P5
ROW2
  Bottom 0.152: U$7.P7 17.89,60.21 13.02,65.09 13.02,71.44 13.65,72.07 13.65,72.82 U$14.41
ROW3  (via drill 0.35)
  Top 0.152: 27.94,58.1 v28.26,57.78 14.08,57.78 8.26,63.61 8.26,74.73 7.3,75.68 7.3,76.2 v6.99,76.52
  Bottom 0.152: U$7.P15 27.03,59.01 v28.26,57.78 | U$14.24 7.01,76.49 v6.99,76.52
ROW4  (via drill 0.35)
  Top 0.152: v28.26,60.01 27.62,59.37 27.62,59.03 26.99,58.4 14.34,58.4 8.89,63.84 v8.89,76.52
  Bottom 0.152: U$14.26 9.21,76.19 v8.89,76.52 | U$7.P17 28.06,59.81 v28.26,60.01
ROW5  (via drill 0.35)
  Top 0.152: v28.26,61.28 26.99,60.01 26.99,59.05 26.63,58.7 14.46,58.7 9.2,63.97 9.2,75.96 9.5,76.27 9.5,76.77 9.14,77.12 8.92,77.12 7.63,78.41 7.63,79.68 6.99,80.33 v6.99,80.96
  Bottom 0.152: U$14.14 5.92,82.03 v6.99,80.96 | v28.26,61.28 27.19,60.21 U$7.P18
ROW6  (via drill 0.35)
  Top 0.152: v27.19,61.07 26.68,60.56 26.68,59.18 26.51,59 14.59,59 9.5,64.09 9.5,75.84 9.8,76.14 9.8,76.89 9.27,77.43 9.04,77.43 7.94,78.54 v7.94,80.96
  Bottom 0.152: U$14.15 7.01,81.89 v7.94,80.96 | v27.19,61.07 26.73,60.61 U$7.P19
ROW7  (via drill 0.35)
  Top 0.152: v8.89,80.96 8.26,80.33 8.26,78.65 9.17,77.73 9.39,77.73 10.11,77.02 10.11,76.01 9.84,75.75 9.84,64.18 14.71,59.31 22.86,59.31 24.51,60.96 24.51,63.88 v26.04,65.41
  Bottom 0.152: U$14.4 7.01,84.95 7.56,84.41 7.56,82.29 v8.89,80.96 | v26.04,65.41 25.08,64.45 25.08,62.9 25.37,62.61 U$7.P24
RTCINT  (via drill 0.35)
  Top 0.152: v12.38,81.6 12.38,81.5 12.99,80.9 12.99,80.47 17.59,75.87 23.62,75.87 35.53,63.96 v35.53,57.47 | v9.21,24.45 12.7,27.94 v12.7,33.66 | v35.88,45.72 v35.88,49.21
  Bottom 0.152: U$14.18 10.31,82.19 10.91,81.6 v12.38,81.6 | U$69.3 1.1,27.83 0.65,27.83 0.52,27.7 0.52,26.91 0.65,26.78 2.83,26.78 3.17,26.43 3.17,25.29 2.93,25.04 2.93,21.84 3.81,20.95 7.3,20.95 9.21,22.86 v9.21,24.45 | v12.7,33.66 12.7,43.5 15.56,46.35 35.24,46.35 v35.88,45.72 | v35.88,49.21 36.2,48.9 39.69,48.9 40.64,49.85 40.64,56.52 39.69,57.47 v35.53,57.47
RXD
  Bottom 0.203: U$14.6 9.21,86.98 10.28,88.04 10.28,88.7 12.7,91.12 19.37,91.12 20.08,91.83 U$17.2
RXEN  (via drill 0.35)
  Top 0.254: v16.83,82.55 43.18,82.55 v45.09,80.64
  Bottom 0.254: U$14.22 14.71,83.08 15.24,82.55 v16.83,82.55 | v45.09,80.64 45.23,80.5 U$36.6
SCK  (via drill 0.35)
  Top 0.152: v12.06,77.15 11.4,77.82 11.4,78.67 11.11,78.96 11.11,82.98 13.86,85.72 39.17,85.72 44.25,90.81 v45.09,90.81 45.09,92.08 45.4,92.39 46.24,92.39 49.86,88.77 49.86,79.25 55.12,73.99 59.56,73.99 60.67,72.88 60.67,72.46 61.28,71.85 v61.28,70.8 61.28,68.8 61.57,68.51 61.57,68.01 59.6,66.04 54.93,66.04 42.55,53.66 v38.73,53.66
  Bottom 0.152: U$14.29 12.52,76.7 v12.06,77.15 | v45.09,90.81 46.04,90.81 46.5,91.27 U$36.18 | v61.28,70.8 61.75,70.33 X4.5 | v38.73,53.66 37.36,53.66 U$10.1
SCL  (via drill 0.35)
  Top 0.152: v6.46,61.48 6.46,59.17 4.55,57.25 R6.1 4.88,55.87 9.02,55.87 9.51,55.37 9.51,54.48 9.21,54.18 9.21,27.94 v9.53,27.62
  Bottom 0.152: U$14.36 8.12,72.25 7.32,71.45 7.32,62.34 v6.46,61.48 | R6.1 3.49,56.2 2.15,54.85 1.54,54.85 0.95,54.27 0.95,51.12 SCL.TP | U3.4 4.37,49.6 5.08,48.9 5.08,47.94 5.74,47.28 6.6,47.28 7.27,46.61 U4.23 | 10.52,19.05 10.52,26 9.21,27.3 | 9.21,27.3 8.57,27.94 5.96,27.94 5.71,27.7 5.71,26.35 6.03,26.04 U$69.8 | v9.53,27.62 9.21,27.3
  Bottom 0.2: U3.4 2.52,50.78 SCL.TP
  Bottom 0.203: U1.2 12.73,15.39 10.52,17.61 10.52,19.05
  other vias: 4.55,56.2
SD_CS  (via drill 0.35)
  Top 0.152: v31.75,74.93 37.47,69.22 v57.47,69.22
  Bottom 0.152: v31.75,74.93 31.52,75.16 31.52,76.69 31.39,76.83 30.3,76.83 30.17,76.69 30.17,75.4 29.39,74.62 26.02,74.62 25.43,75.22 22.11,75.22 21.98,75.36 21.98,76.9 21.7,77.18 20.21,77.18 19.89,76.86 16.53,76.86 15.56,75.88 15.56,74.61 14.71,73.77 U$14.42 | v57.47,69.22 59.65,67.03 X4.2
SD_DET  (via drill 0.35)
  Top 0.152: v5.71,79.38 6.02,79.07 6.02,77.93 5.07,76.97 5.07,76.12 5.63,75.56 6.06,75.56 7.28,74.34 7.28,69.51 6.35,68.58 SJ7.1 | v28.26,79.06 29.21,79.06 32.38,75.88 32.38,74.73 37.58,69.53 52.07,69.53 v52.7,70.17
  Bottom 0.152: v5.71,79.38 6.03,79.06 9.09,79.06 10.03,80 16,80 16.94,79.06 19.14,79.06 19.39,78.81 28.02,78.81 v28.26,79.06 | 52.51,70.36 v52.7,70.17 53.15,70.61 X4.CD1
SDA  (via drill 0.35)
  Top 0.152: v5.4,61.28 6.03,60.64 6.03,59.17 4.24,57.38 4.24,56.75 3.94,56.45 3.94,55.22 R9.1 6.03,54.61 6.35,54.61 7.3,54.61 8.26,55.56 8.89,55.56 9.21,55.24 9.21,54.61 8.89,54.29 8.89,26.04 v9.21,25.72
  Bottom 0.152: U$14.35 7.01,62.9 v5.4,61.28 | R9.1 2.01,52.07 SDA.TP | U3.3 4.77,51.43 5.32,50.88 5.32,49.25 5.4,49.18 5.4,48.06 5.83,47.62 6.69,47.62 7.57,46.74 7.57,46.52 7.67,46.42 U4.24 | 10.16,19.05 10.16,25.72 9.68,26.19 | 9.68,26.19 8.57,27.3 U$69.7 | v9.21,25.72 9.68,26.19
  Bottom 0.2: U3.3 2.55,51.43 SDA.TP
  Bottom 0.203: U1.1 12.34,15.29 10.16,17.46 10.16,19.05
  other vias: 4.55,54.61
SWCLK
  Bottom 0.152: J3.4 8.57,59.69 10.31,61.43 U$14.38
SWDIO
  Bottom 0.152: J3.2 4.46,59.38 8.7,59.38 10.86,61.55 10.86,73.59 10.73,73.72 9.9,73.72 9.21,73.04 U$14.37
SWITCH  (via drill 0.35)
  Top 0.152: v4.13,47.62 8.26,47.62 8.57,47.94 v8.57,54.93
  Bottom 0.152: U$14.39 11.41,71.74 11.17,71.49 11.17,61.42 8.57,58.83 v8.57,54.93 | v4.13,47.62 2.67,47.62 DWN2.1
TS
  Bottom 0.2: U1.10 13.13,9.64 12.38,8.89 R11.2
TXD
  Bottom 0.203: U$14.7 10.31,87.47 10.79,87.95 10.79,88.72 12.85,90.77 19.52,90.77 20.19,91.44 20.64,91.44 21.08,91.88 U$17.3
TXEN  (via drill 0.35)
  Top 0.254: v16.83,81.6 17.46,81.6 18.01,82.14 42.95,82.14 43.81,81.28 v43.81,80.64
  Bottom 0.254: U$14.21 13.65,83.82 13.65,83.19 15.24,81.6 v16.83,81.6 | v43.81,80.64 43.81,78.86 U$36.7
USB_N  (via drill 0.35)
  Top 0.152: v33.98,8.89 33.76,8.68 31.27,11.18 31.27,34.35 26.82,38.8 26.82,51.05 30,54.23 30,68.33 24.35,73.98 v24.13,73.98
  Bottom 0.152: J2.A7 34.04,7.62 | 34.04,7.62 34.04,8.4 33.76,8.68 v33.98,8.89 | J2.B7 35.04,7.5 34.92,7.62 34.04,7.62 | v24.13,73.98 23.81,73.98 23.5,74.3 R15.1
USB_P  (via drill 0.35)
  Top 0.152: v33.12,8.46 33.23,8.78 30.96,11.05 30.96,34.23 26.52,38.67 26.52,51.18 29.69,54.36 29.69,68.2 24.7,73.19 24.3,73.19 v24.13,73.03
  Bottom 0.152: v33.12,8.46 33.55,8.15 33.54,8.14 J2.B6 33.54,5.2 33.66,5.08 34.29,5.08 34.54,5.33 J2.A6 | v24.13,73.03 23.81,72.71 R14.1
VBAT
  Bottom 0.2: U1.7 14.34,9.48 15.24,8.57 15.24,7.93 R5.2
  Bottom 0.305: 34.01,13.4 34.01,11.02 Q3.3
  Bottom 0.406: 33.66,14.29 33.66,13.76 34.01,13.4
  Bottom 0.61: R5.2 16.82,6.35 24.45,6.35 25.4,7.3 25.4,9.53 | 25.4,9.53 C1.1 25.14,10.1 U$47.5 | 25.4,9.53 27.94,9.53 28.57,10.16 28.57,14.92 29.53,15.88 33.34,15.88 33.66,15.56 33.66,14.29
VBUS  (via drill 0.35)
  Top 0.254: D3.A D5.A
  Top 0.305: D5.A 36.73,1.49 38.42,3.17 39.37,3.17 40.01,3.81 40.01,6.35 38.73,7.62 v36.74,7.62 36.51,7.62
  Top 0.406: v18.1,9.84 18.1,15.88 19.37,17.14 v23.5,17.14 | v16.83,74.93 22.23,74.93 23.4,73.76 23.4,72.72 24.05,72.07 25.21,72.07 29.26,68.02 29.26,54.53 26.09,51.36 26.09,38.49 30.53,34.05 30.53,20.05 v29.84,19.37
  Bottom 0.305: 34.96,11.4 34.61,11.76 34.61,13.37 34.8,13.56 34.83,13.56 34.92,13.65
  Bottom 0.406: R2.2 32.23,14.5 D1.A | 34.96,11.4 34.96,10.09 34.67,9.8 34.67,9.78 | 34.92,13.65 34.92,14.29 | U$47.8 19.43,9.84 v18.1,9.84 | v23.5,17.14 U$47.4 | C9.1 20.85,76.31 U$14.47 18.3,76.2 17.64,76.2 16.83,75.39 v16.83,74.93 | v29.84,19.37 29.84,18.1
  Bottom 0.61: U$47.4 25.14,15.3 C10.2 27.94,18.1 29.84,18.1 33.66,18.1 34.92,16.83 34.92,14.29 | J2.VBUS2 31.84,9.3 32.86,10.32 | 32.86,10.32 33.34,10.8 Q3.1 32.44,13.65 D1.A | J2.VBUS1 v36.74,7.62 36.74,7.71 34.67,9.78 33.78,9.78 33.25,10.32 32.86,10.32
VHI  (via drill 0.35)
  Top 0.61: v39.37,9.21 39.37,8.89 36.2,8.89 33.97,6.67 32.07,6.67 31.11,7.62 29.21,7.62 25.4,3.81 23.18,3.81 v22.23,4.76
  Bottom 0.406: U$46.+ 19.06,3.3 C16.2 21.84,3.3 D6.C | C11.2 53.18,13.91 53.18,13.48
  Bottom 0.61: U$45.P 49.41,6.24 50.96,7.78 | 50.96,7.78 51.12,7.94 52.7,7.94 54.64,9.87 IC1.3 53.97,10.48 53.34,11.11 | 53.34,11.11 53.02,11.43 IC1.5 | 53.18,13.48 53.18,13.33 53.34,13.17 53.34,11.11 | U2.1 42.87,10.48 43.18,10.79 43.18,13.34 44.03,14.19 R20.1 | U2.1 C7.2 v39.37,9.21 v39.37,9.84 | D6.C v22.23,4.76 v21.59,4.76 | U2.1 42.96,10.48 44.04,9.4 49.34,9.4 50.96,7.78

### Text on the board
tPlace: 305060 battery?
bPlace: 5V | 3V | int | ext | 5V | 3V | BME280 | 0x77 | 0x76 | ICM-20948 | 9-DOF IMU | DS3231M | RTC | Low Power LORA QWERTY Communicator | v1.1 / A. Jordan 2021 | + | - | - +